# EAGLE board foxBMS_BMS-Slave (EAGLE 6.5.0), part 1 of 3
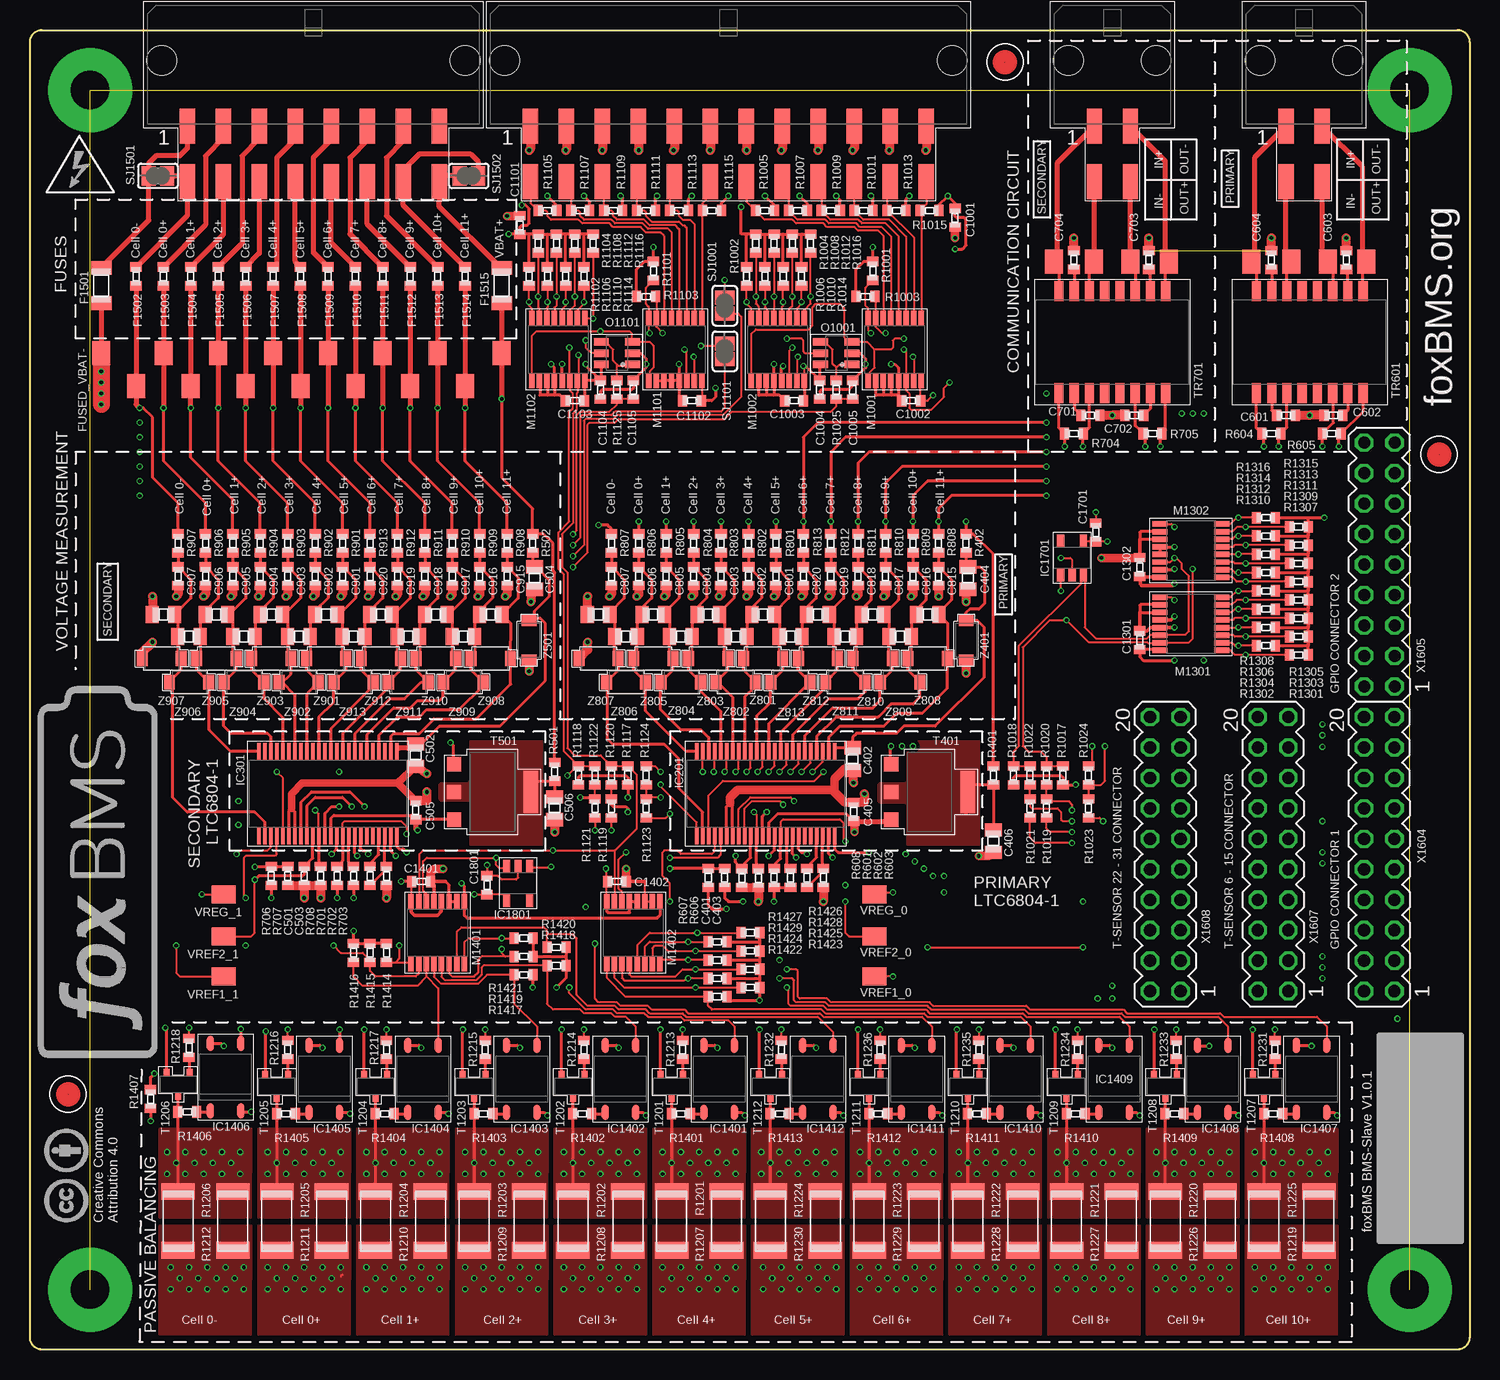
[diagram p19: board, top side]
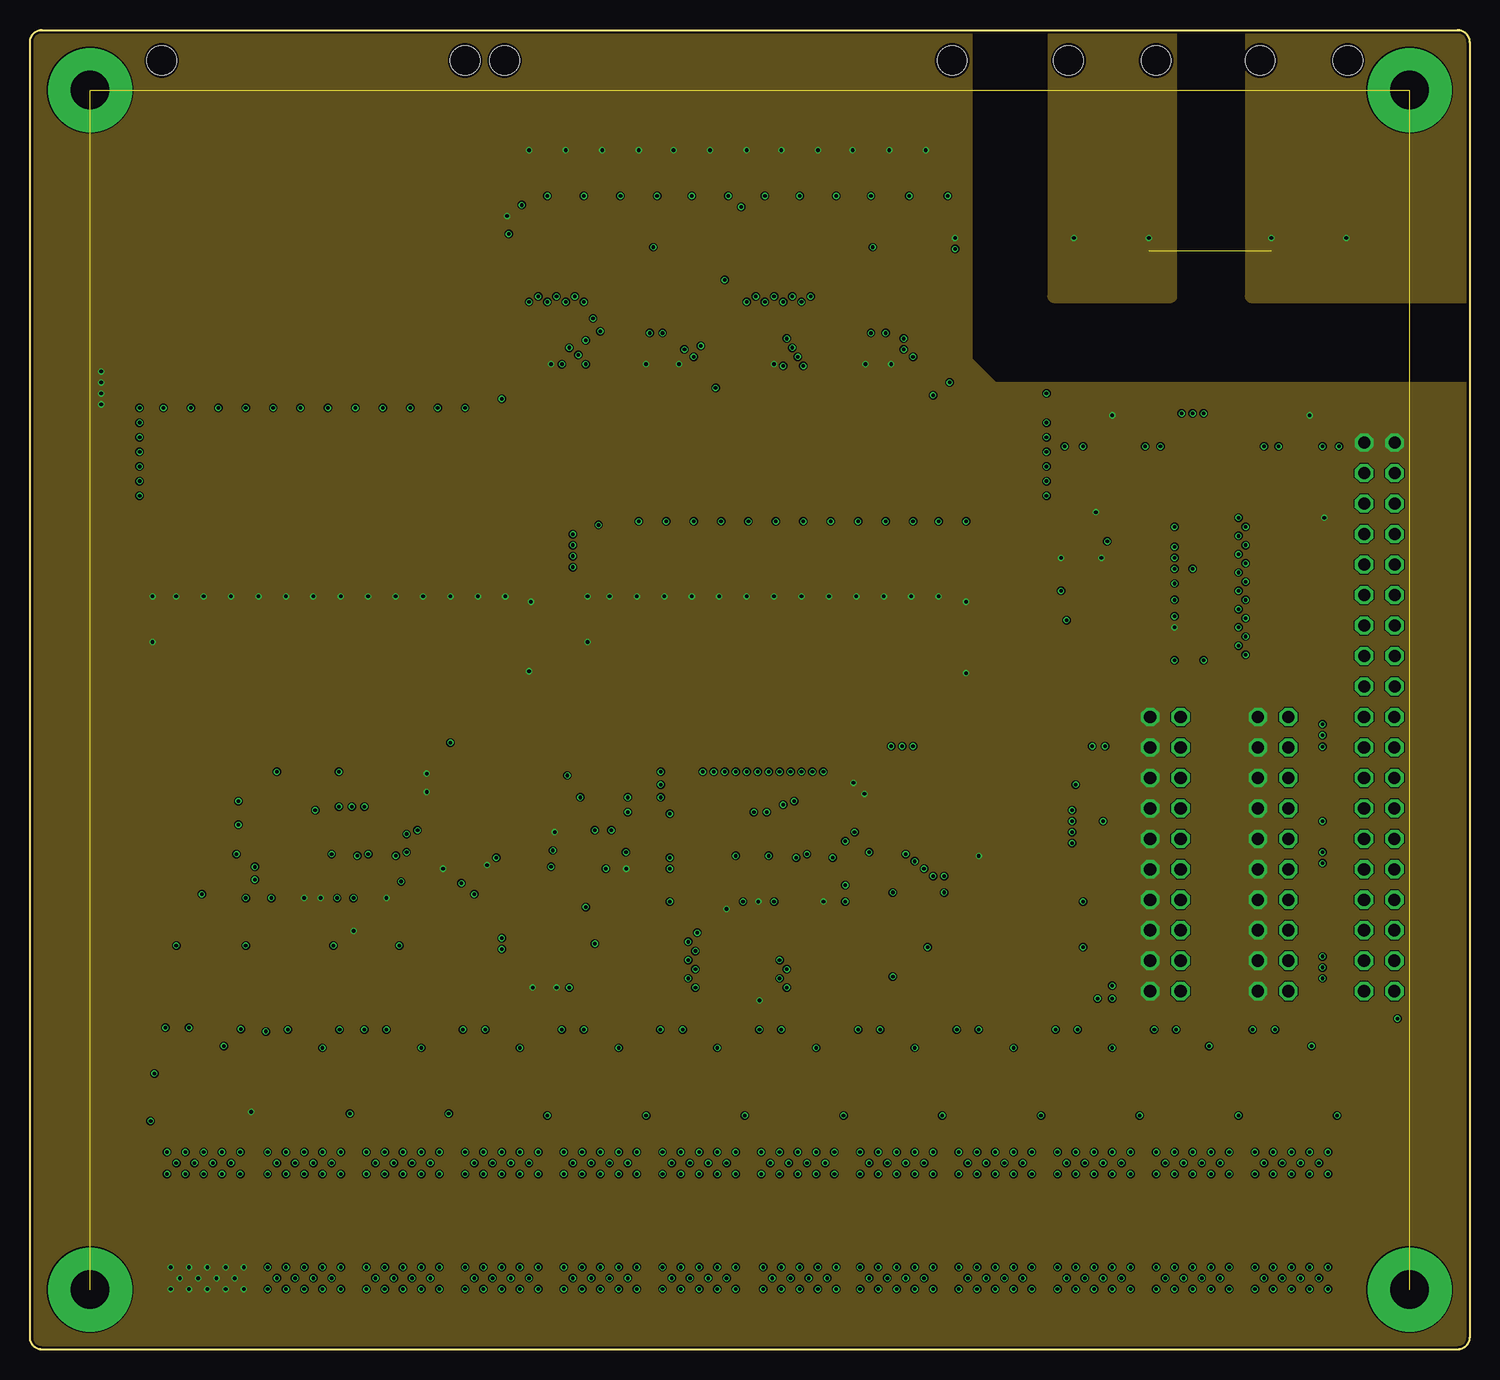
[diagram p20: board, inner layer FUSED_VBAT-]
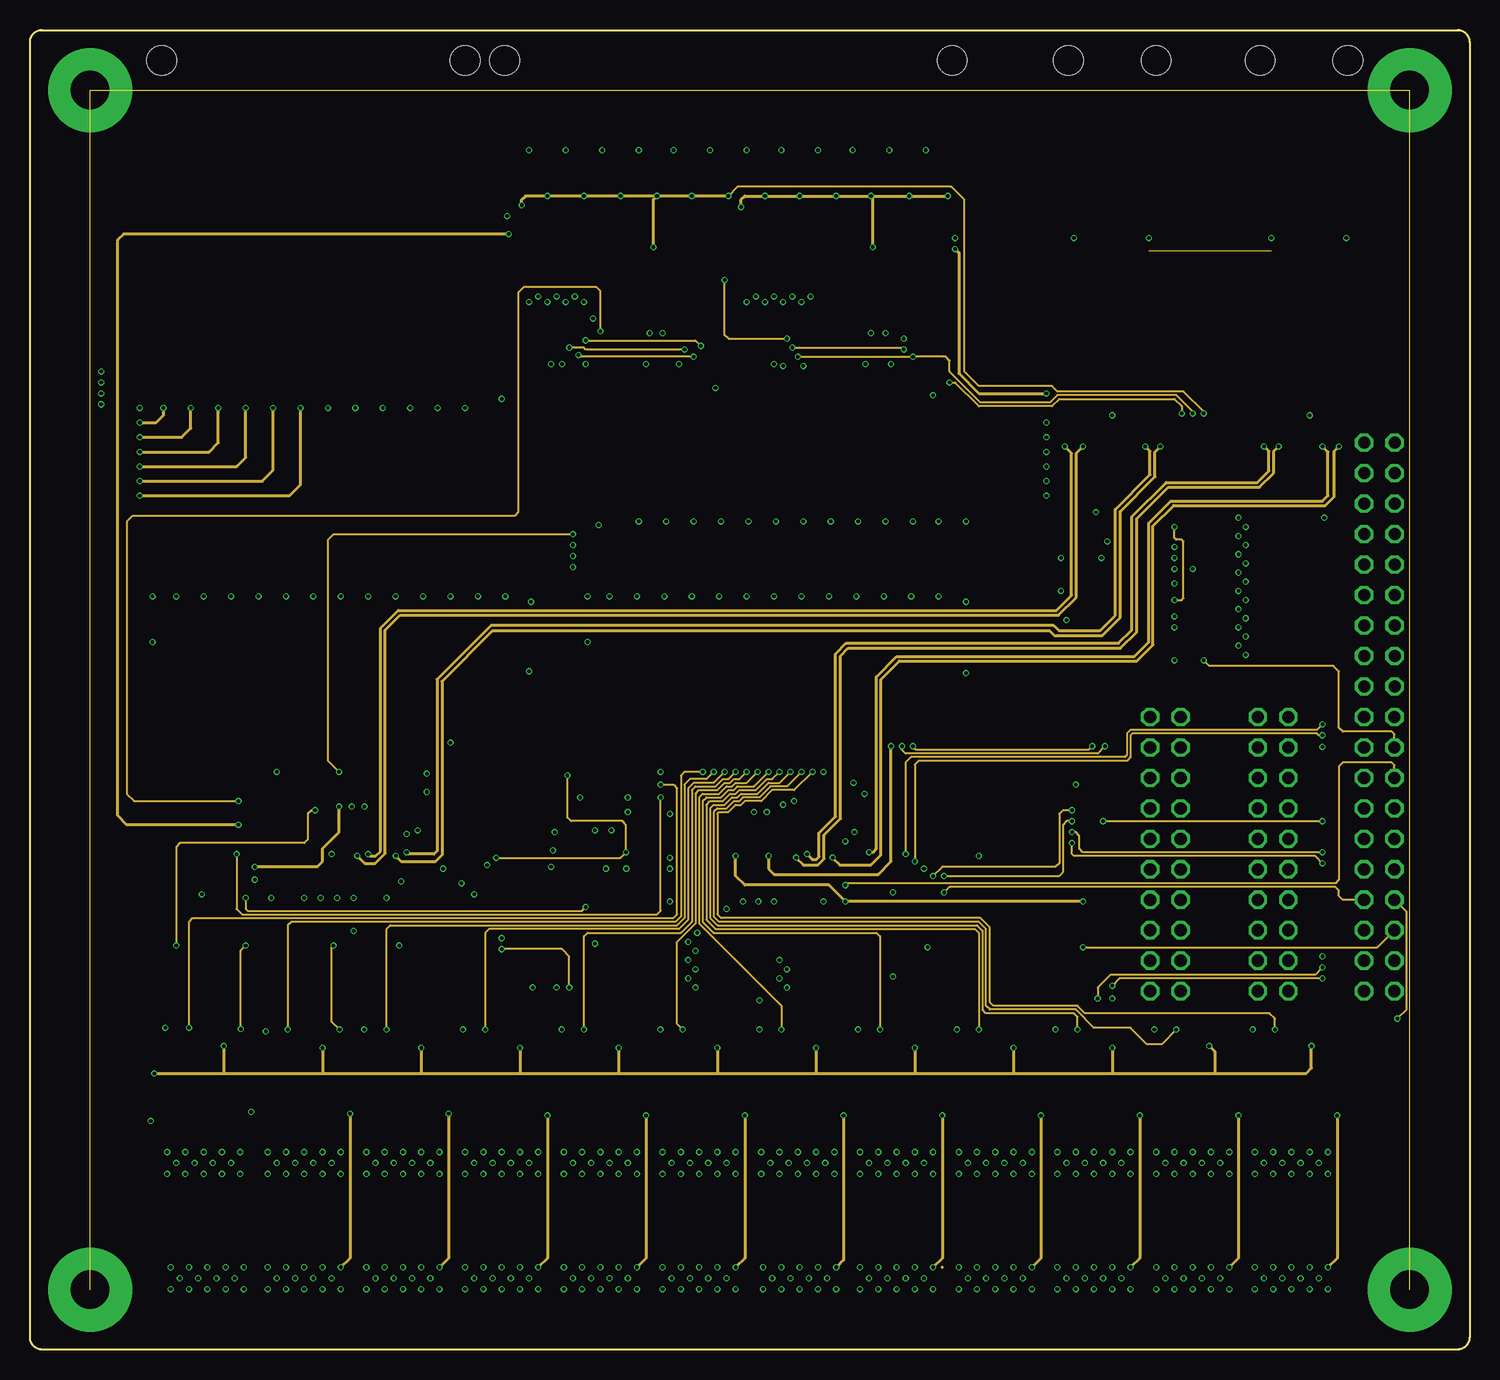
[diagram p21: board, inner layer Signals1]
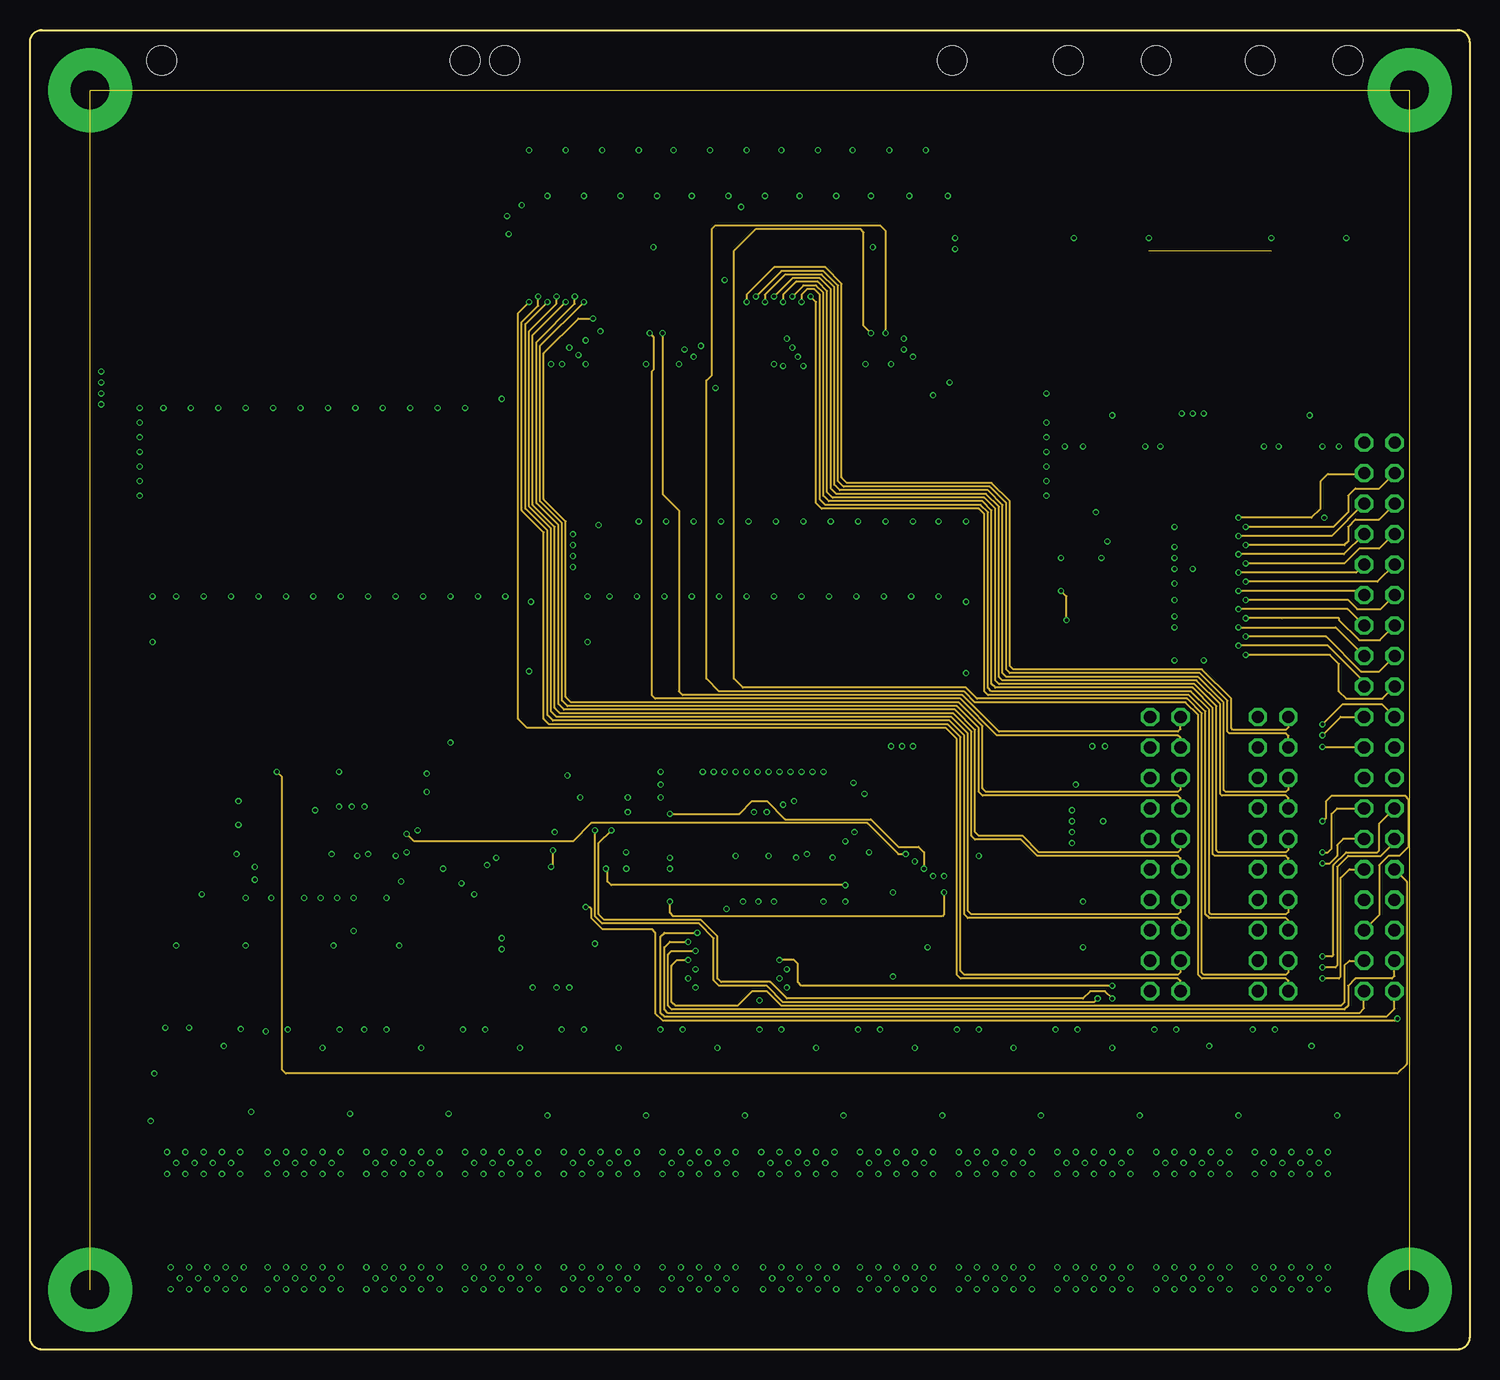
[diagram p22: board, inner layer Signals2]
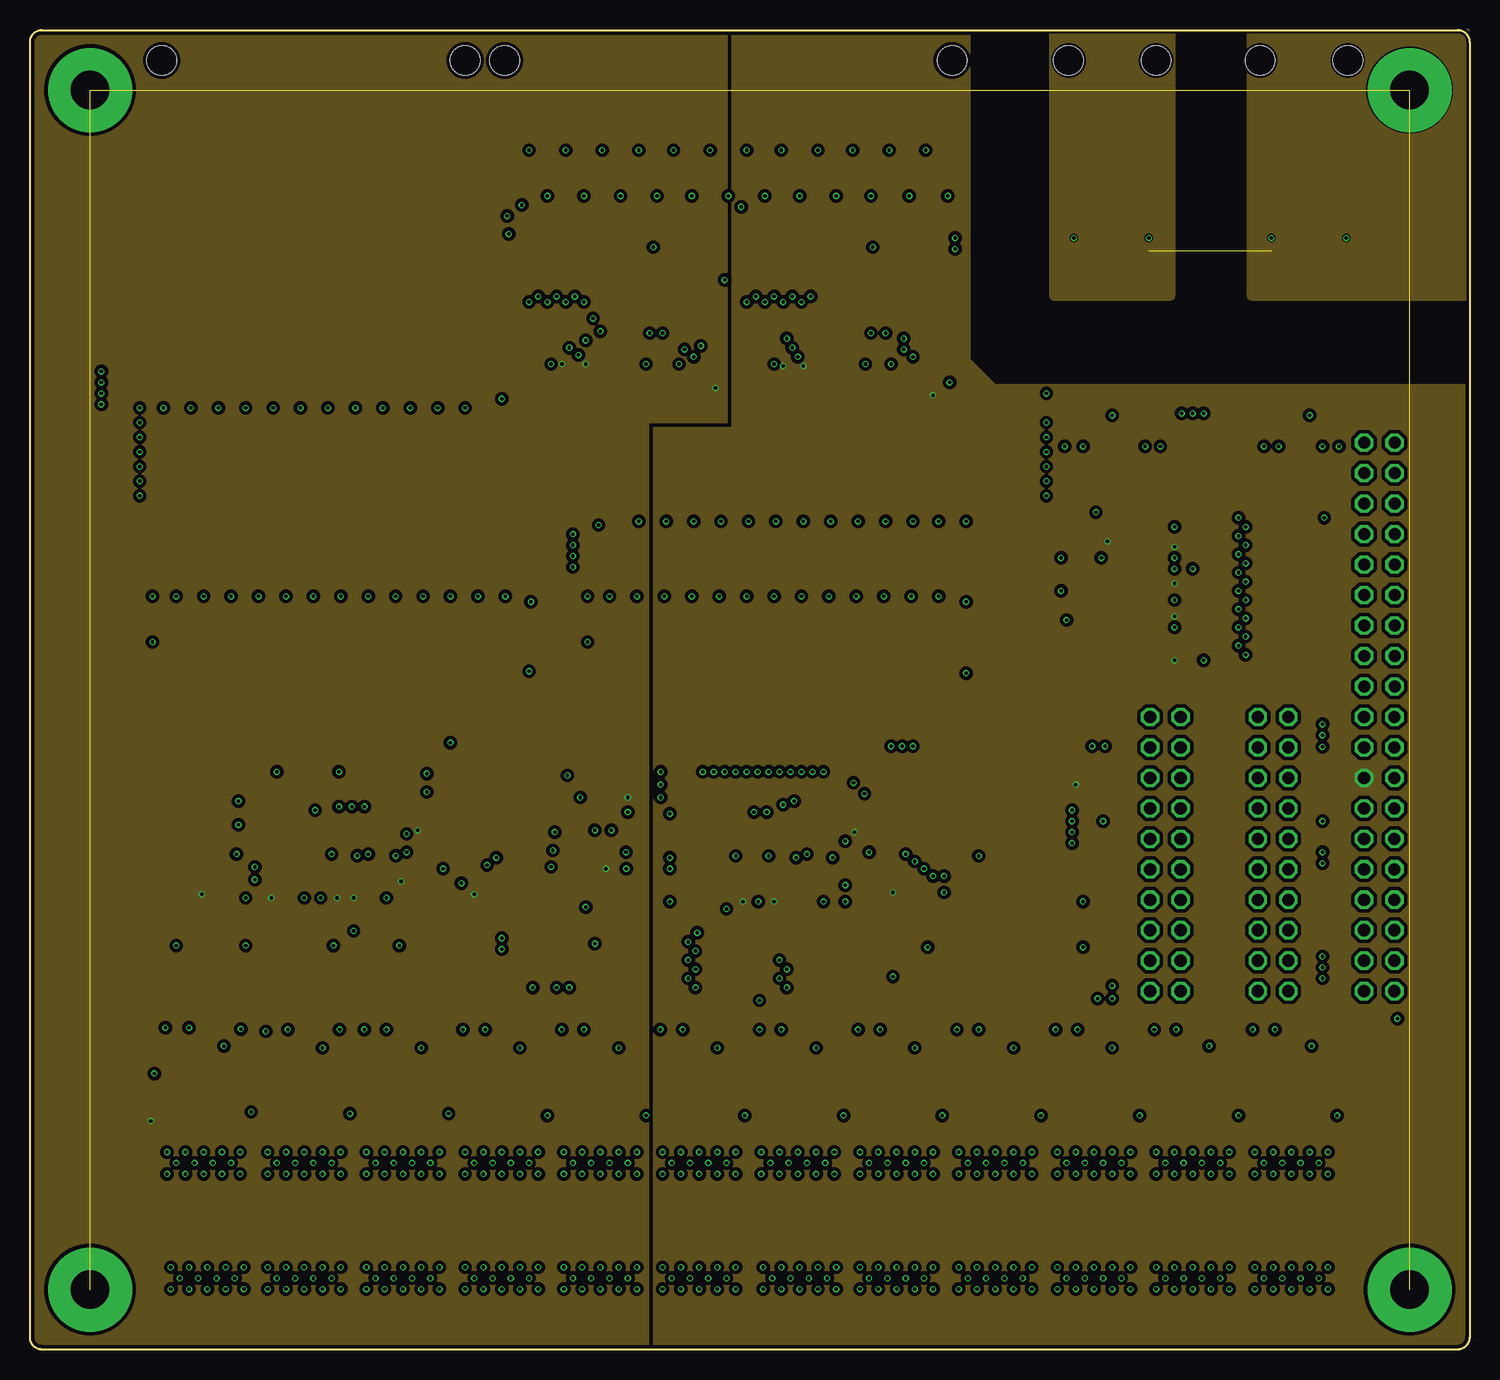
[diagram p23: board, inner layer V_REG]
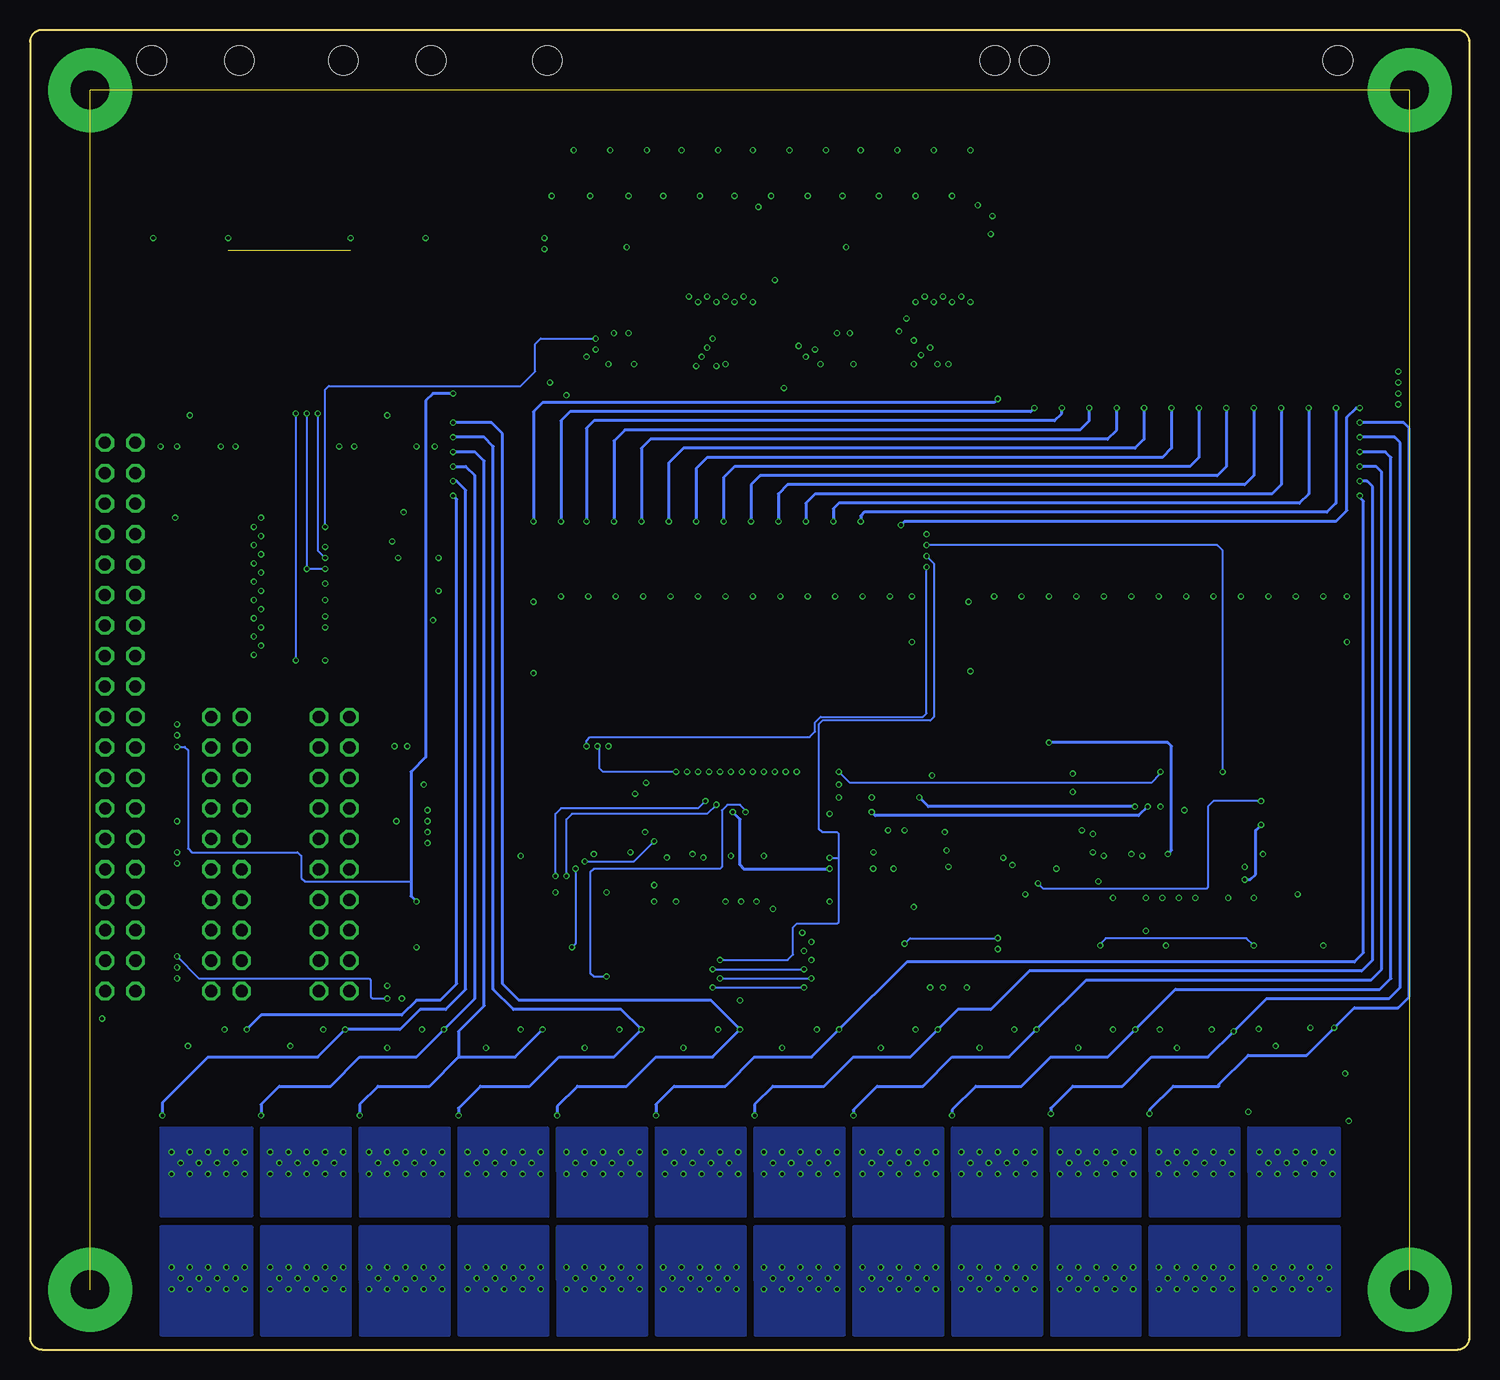
[diagram p24: board, bottom side, seen from below]

Size 120 x 110 mm. Coordinates in mm from the lower left corner, seen from the top.
Outline: 119,0 1,0 arc-90 0,1 0,109 arc-90 1,110 119,110 arc-90 120,109 120,1 arc-90 119,0
Copper layers (1+2*3+4*5+16): Top 0.018mm / dielectric 0.2mm / FUSED_VBAT- 0.035mm / dielectric 0.36mm / Signals1 0.035mm / dielectric 0.3mm / Signals2 0.035mm / dielectric 0.36mm / V_REG 0.035mm / dielectric 0.2mm / Bottom 0.018mm
Design rules "Multi-CB_6L_100um-Tracks_OL35um-IL35um": minimum track width 0.1mm, minimum drill 0.2mm, track to track 0.1mm, track to pad 0.1mm, pad to pad 0.1mm, via to via 0.1mm, smd to smd 0mil, copper to edge 0.2mm, drill to drill 0.2mm, minimum pad ring 0.1mm, minimum via ring 0.1mm, stop-mask expansion 2mil, vias tented up to drill 0.45mm, thermal gap 0.2mm
Net classes: 1 DiffPair: width 0.254 mm

## Footprints (pad centres in the part's own frame; a part is rotated, then mirrored left to right if it is on the bottom)
0603 = smd 0.762 x 0.965: 1 -0.787,0; 2 0.787,0
0805 = smd 1.092 x 1.397: 1 -0.94,0; 2 0.94,0
1206 = smd 1.143 x 1.702: 1 -1.473,0; 2 1.473,0
IC_SMD_SSOP-48_(G48)_R_LINEAR_REV01 = smd 0.295 x 1.37: 1 -5.75,-3.535; 2 -5.25,-3.535; 3 -4.75,-3.535; 4 -4.25,-3.535; 5 -3.75,-3.535; 6 -3.25,-3.535; 7 -2.75,-3.535; 8 -2.25,-3.535; 9 -1.75,-3.535; 10 -1.25,-3.535; 11 -0.75,-3.535; 12 -0.25,-3.535; 13 0.25,-3.535; 14 0.75,-3.535; 15 1.25,-3.535; 16 1.75,-3.535; 17 2.25,-3.535; 18 2.75,-3.535; 19 3.25,-3.535; 20 3.75,-3.535; 21 4.25,-3.535; 22 4.75,-3.535; 23 5.25,-3.535; 24 5.75,-3.535; 25 5.75,3.535; 26 5.25,3.535; 27 4.75,3.535; 28 4.25,3.535; 29 3.75,3.535; 30 3.25,3.535; 31 2.75,3.535; 32 2.25,3.535; 33 1.75,3.535; 34 1.25,3.535; 35 0.75,3.535; 36 0.25,3.535; 37 -0.25,3.535; 38 -0.75,3.535; 39 -1.25,3.535; 40 -1.75,3.535; 41 -2.25,3.535; 42 -2.75,3.535; 43 -3.25,3.535; 44 -3.75,3.535; 45 -4.25,3.535; 46 -4.75,3.535; 47 -5.25,3.535; 48 -5.75,3.535
K_SMD_SOP-4_R_IXYS_REV01 = smd 0.6 x 1.3: 1 -1.27,-2.8; 2 1.27,-2.8; 3 1.27,2.8; 4 -1.27,2.8
IC_SMD_SOT23-5_R_MICROCHIP_REV01 = smd 0.6 x 1.1: 1 -0.95,-1.4; 2 0,-1.4; 3 0.95,-1.4; 4 0.95,1.4; 5 -0.95,1.4
PAD2.0X1.5MM = smd 2 x 1.5: P$1 0,0
IC_SMD_SSOP-16_(GN16)_R_LINEAR_REV01 = smd 0.457 x 1.27: 1 -2.223,-2.591; 2 -1.587,-2.591; 3 -0.953,-2.591; 4 -0.318,-2.591; 5 0.318,-2.591; 6 0.953,-2.591; 7 1.587,-2.591; 8 2.223,-2.591; 9 2.223,2.591; 10 1.587,2.591; 11 0.953,2.591; 12 0.318,2.591; 13 -0.318,2.591; 14 -0.953,2.591; 15 -1.587,2.591; 16 -2.223,2.591
IC_SMD_TSOT-23-6_(S6)_R_LINEAR_REV01 = smd 0.62 x 1.22: 1 -0.95,-1.31; 2 0,-1.31; 3 0.95,-1.31; 4 0.95,1.31; 5 0,1.31; 6 -0.95,1.31
2010 = smd 1.4 x 2.8: 1 -2.4,0; 2 2.5,0
SJ = smd 1.168 x 1.6: 1 -0.66,0; 2 0.66,0
SJ' = smd 1.168 x 1.6: 1 -0.762,0; 2 0.762,0
D_SMD_SOT223_(SC-73)_R_NXP_REV01 = smd 1.2 x 1.2: 1 -2.3,-3.2; 2 0,-3.2; 3 2.3,-3.2 | smd 3.5 x 1.2: 4 0,3.2
D_SMD_SOT23_(TO-236AB)_R_NXP_REV01 = smd 0.5 x 0.6: 1 -0.95,-1; 2 0.95,-1; 3 0,1
TR_SMD_SOIC-16_(12,70MMX9,53MMX5,97MM)_R_PULSE_REV01 = smd 0.76 x 1.65: 1 -4.445,-4.255; 2 -3.175,-4.255; 3 -1.905,-4.255; 4 -0.635,-4.255; 5 0.635,-4.255; 6 1.905,-4.255; 7 3.175,-4.255; 8 4.445,-4.255; 9 4.445,4.255; 10 3.175,4.255; 11 1.905,4.255; 12 0.635,4.255; 13 -0.635,4.255; 14 -1.905,4.255; 15 -3.175,4.255; 16 -4.445,4.255
X_SMD_MOLEX_43045-0408_R_REV01 = smd 1.27 x 2.92: 1 1.5,5.47; 2 -1.5,5.47; 3 1.5,10.1; 4 -1.5,10.1 | hole 2.46: -3.65,0; 3.65,0
X_SMD_MOLEX_43045-1608_R_REV01 = smd 1.27 x 2.92: 1 10.5,5.47; 2 7.5,5.47; 3 4.5,5.47; 4 1.5,5.47; 5 -1.5,5.47; 6 -4.5,5.47; 7 -7.5,5.47; 8 -10.5,5.47; 9 10.5,10.1; 10 7.5,10.1; 11 4.5,10.1; 12 1.5,10.1; 13 -1.5,10.1; 14 -4.5,10.1; 15 -7.5,10.1; 16 -10.5,10.1 | hole 2.46: 12.65,0; -12.65,0
MA10-2 = drill 1.016 pad 1.524 octagon: 1 -11.43,-1.27; 2 -11.43,1.27; 3 -8.89,-1.27; 4 -8.89,1.27; 5 -6.35,-1.27; 6 -6.35,1.27; 7 -3.81,-1.27; 8 -3.81,1.27; 9 -1.27,-1.27; 10 -1.27,1.27; 11 1.27,-1.27; 12 1.27,1.27; 13 3.81,-1.27; 14 3.81,1.27; 15 6.35,-1.27; 16 6.35,1.27; 17 8.89,-1.27; 18 8.89,1.27; 19 11.43,-1.27; 20 11.43,1.27
MA09-2 = drill 1.016 octagon: 1 -10.16,-1.27; 2 -10.16,1.27; 3 -7.62,-1.27; 4 -7.62,1.27; 5 -5.08,-1.27; 6 -5.08,1.27; 7 -2.54,-1.27; 8 -2.54,1.27; 9 0,-1.27; 10 0,1.27; 11 2.54,-1.27; 12 2.54,1.27; 13 5.08,-1.27; 14 5.08,1.27; 15 7.62,-1.27; 16 7.62,1.27; 17 10.16,-1.27; 18 10.16,1.27
X_SMD_MOLEX_43045-2408_R_REV01 = smd 1.27 x 2.92: 1 16.5,5.47; 2 13.5,5.47; 3 10.5,5.47; 4 7.5,5.47; 5 4.5,5.47; 6 1.5,5.47; 7 -1.5,5.47; 8 -4.5,5.47; 9 -7.5,5.47; 10 -10.5,5.47; 11 -13.5,5.47; 12 -16.5,5.47; 13 16.5,10.1; 14 13.5,10.1; 15 10.5,10.1; 16 7.5,10.1; 17 4.5,10.1; 18 1.5,10.1; 19 -1.5,10.1; 20 -4.5,10.1; 21 -7.5,10.1; 22 -10.5,10.1; 23 -13.5,10.1; 24 -16.5,10.1 | hole 2.46: 18.65,0; -18.65,0
D_SMD_SOD-123_R_ON_REV01 = smd 0.91 x 1.22: A -1.635,0; K 1.635,0

## Placement (x,y rotation side)
C401  1uF, 20%, 16V  [0603]  59.35,39.3 90 top
C402  100nF, 10%, 100V  [0805]  68.58,49.23 270 top
C403  1uF, 20%, 16V  [0603]  60.72,39.3 90 top
C404  100nF, 10%, 100V  [0805]  78.18,64.31 270 top
C405  1uF, 20%, 16V  [0603]  68.67,44.82 270 top
C406  100nF, 10%, 100V  [0805]  80.31,42.37 90 top
C501  1uF, 20%, 16V  [0603]  22.86,39.47 90 top
C502  100nF, 10%, 100V  [0805]  32.16,49.53 270 top
C503  1uF, 20%, 16V  [0603]  24.23,39.47 90 top
C504  100nF, 10%, 100V  [0805]  42.06,64.31 270 top
C505  1uF, 20%, 16V  [0603]  32.16,44.96 270 top
C506  100nF, 10%, 100V  [0805]  43.74,45.11 90 top
C601  100pF, 15%, 25V  [0603]  104.7,77.88 180 top
C602  100pF, 15%, 25V  [0603]  108.66,77.88 0 top
C603  1uF, 20%, 25V  [0603]  109.73,90.83 270 top
C604  1uF, 20%, 25V  [0603]  103.48,90.83 270 top
C701  100pF, 15%, 25V  [0603]  88.39,77.88 180 top
C702  100pF, 15%, 25V  [0603]  92.05,77.88 0 top
C703  1uF, 20%, 25V  [0603]  93.27,90.83 270 top
C704  1uF, 20%, 25V  [0603]  87.02,90.83 270 top
C801  10nF, 100V, 10%  [0603]  62.18,64.47 270 top
C802  10nF, 100V, 10%  [0603]  59.89,64.47 270 top
C803  10nF, 100V, 10%  [0603]  57.61,64.47 270 top
C804  10nF, 100V, 10%  [0603]  55.32,64.47 270 top
C805  10nF, 100V, 10%  [0603]  53.04,64.47 270 top
C806  10nF, 100V, 10%  [0603]  50.75,64.47 270 top
C807  10nF, 100V, 10%  [0603]  48.46,64.47 270 top
C808  OPT: 100nF, 25V  [0805]  61.11,61.26 0 top
C809  OPT: 100nF, 25V  [0805]  58.83,59.44 0 top
C810  OPT: 100nF, 25V  [0805]  56.54,61.26 0 top
C811  OPT: 100nF, 25V  [0805]  54.25,59.44 0 top
C812  OPT: 100nF, 25V  [0805]  51.97,61.26 0 top
C813  OPT: 100nF, 25V  [0805]  49.68,59.44 0 top
C814  OPT: 100nF, 25V  [0805]  47.4,61.26 0 top
C815  10nF, 100V, 10%  [0603]  75.74,64.47 270 top
C816  10nF, 100V, 10%  [0603]  73.61,64.47 270 top
C817  10nF, 100V, 10%  [0603]  71.32,64.47 270 top
C818  10nF, 100V, 10%  [0603]  69.04,64.47 270 top
C819  10nF, 100V, 10%  [0603]  66.75,64.47 270 top
C820  10nF, 100V, 10%  [0603]  64.47,64.47 270 top
C821  OPT: 100nF, 25V  [0805]  74.83,61.26 0 top
C822  OPT: 100nF, 25V  [0805]  72.54,59.44 0 top
C823  OPT: 100nF, 25V  [0805]  70.26,61.26 0 top
C824  OPT: 100nF, 25V  [0805]  67.97,59.44 0 top
C825  OPT: 100nF, 25V  [0805]  65.68,61.26 0 top
C826  OPT: 100nF, 25V  [0805]  63.4,59.44 0 top
C901  10nF, 100V, 10%  [0603]  26.06,64.47 270 top
C902  10nF, 100V, 10%  [0603]  23.77,64.47 270 top
C903  10nF, 100V, 10%  [0603]  21.49,64.47 270 top
C904  10nF, 100V, 10%  [0603]  19.2,64.47 270 top
C905  10nF, 100V, 10%  [0603]  16.92,64.47 270 top
C906  10nF, 100V, 10%  [0603]  14.63,64.47 270 top
C907  10nF, 100V, 10%  [0603]  12.34,64.47 270 top
C908  OPT: 100nF, 25V  [0805]  24.69,61.26 0 top
C909  OPT: 100nF, 25V  [0805]  22.4,59.44 0 top
C910  OPT: 100nF, 25V  [0805]  20.12,61.26 0 top
C911  OPT: 100nF, 25V  [0805]  17.83,59.44 0 top
C912  OPT: 100nF, 25V  [0805]  15.54,61.26 0 top
C913  OPT: 100nF, 25V  [0805]  13.26,59.44 0 top
C914  OPT: 100nF, 25V  [0805]  11.13,61.26 0 top
C915  10nF, 100V, 10%  [0603]  39.78,64.47 270 top
C916  10nF, 100V, 10%  [0603]  37.49,64.47 270 top
C917  10nF, 100V, 10%  [0603]  35.2,64.47 270 top
C918  10nF, 100V, 10%  [0603]  32.92,64.47 270 top
C919  10nF, 100V, 10%  [0603]  30.63,64.47 270 top
C920  10nF, 100V, 10%  [0603]  28.35,64.47 270 top
C921  OPT: 100nF, 25V  [0805]  38.4,61.26 0 top
C922  OPT: 100nF, 25V  [0805]  36.12,59.44 0 top
C923  OPT: 100nF, 25V  [0805]  33.83,61.26 0 top
C924  OPT: 100nF, 25V  [0805]  31.55,59.44 0 top
C925  OPT: 100nF, 25V  [0805]  29.26,61.26 0 top
C926  OPT: 100nF, 25V  [0805]  26.97,59.44 0 top
C1001  100nF, 20%, 16V  [0603]  77.11,94.34 90 top
C1002  1uF, 20%, 16V  [0603]  73.46,79.1 0 top
C1003  1uF, 20%, 16V  [0603]  63.7,79.1 0 top
C1004  1uF, 20%, 16V  [0603]  65.84,80.01 90 top
C1005  10nF, 20%, 16V  [0603]  68.58,80.01 270 top
C1101  100nF, 20%, 16V  [0603]  40.84,93.73 270 top
C1102  1uF, 20%, 16V  [0603]  55.17,79.1 0 top
C1103  1uF, 20%, 16V  [0603]  45.42,79.1 0 top
C1104  1uF, 20%, 16V  [0603]  47.55,80.01 90 top
C1105  10nF, 20%, 16V  [0603]  50.29,80.01 270 top
C1301  1uF, 20%, 16V  [0603]  92.51,59.13 270 top
C1302  1uF, 20%, 16V  [0603]  92.51,65.23 270 top
C1401  1uF, 20%, 16V  [0603]  32.61,39.01 180 top
C1402  1uF, 20%, 16V  [0603]  48.92,39.01 180 top
C1701  100nF, 20%, 16V  [0603]  88.85,68.12 270 top
C1801  100nF, 20%, 16V  [0603]  38.1,38.71 270 top
F1501  0.5A, 63V, 0.25R  [1206]  5.94,88.7 270 top
F1502  FUSE: 0.250A, 32V, 0.57R  [0603]  8.84,89.46 270 top
F1503  FUSE: 0.250A, 32V, 0.57R  [0603]  11.13,89.46 270 top
F1504  FUSE: 0.250A, 32V, 0.57R  [0603]  13.41,89.46 270 top
F1505  FUSE: 0.250A, 32V, 0.57R  [0603]  15.7,89.46 270 top
F1506  FUSE: 0.250A, 32V, 0.57R  [0603]  17.98,89.46 270 top
F1507  FUSE: 0.250A, 32V, 0.57R  [0603]  20.27,89.46 270 top
F1508  FUSE: 0.250A, 32V, 0.57R  [0603]  22.56,89.46 270 top
F1509  FUSE: 0.250A, 32V, 0.57R  [0603]  24.84,89.46 270 top
F1510  FUSE: 0.250A, 32V, 0.57R  [0603]  27.13,89.46 270 top
F1511  FUSE: 0.250A, 32V, 0.57R  [0603]  29.41,89.46 270 top
F1512  FUSE: 0.250A, 32V, 0.57R  [0603]  31.7,89.46 270 top
F1513  FUSE: 0.250A, 32V, 0.57R  [0603]  33.99,89.46 270 top
F1514  FUSE: 0.250A, 32V, 0.57R  [0603]  36.27,89.46 270 top
F1515  0.5A, 63V, 0.25R  [1206]  39.32,88.7 270 top
IC201  LTC6804HG-1#PBF  [IC_SMD_SSOP-48_(G48)_R_LINEAR_REV01]  61.33,46.33 180 top
IC301  LTC6804HG-1#PBF  [IC_SMD_SSOP-48_(G48)_R_LINEAR_REV01]  24.84,46.33 180 top
IC1401  CPC1008N  [K_SMD_SOP-4_R_IXYS_REV01]  57.45,22.56 0 top
IC1402  CPC1008N  [K_SMD_SOP-4_R_IXYS_REV01]  49.23,22.56 0 top
IC1403  CPC1008N  [K_SMD_SOP-4_R_IXYS_REV01]  41,22.56 0 top
IC1404  CPC1008N  [K_SMD_SOP-4_R_IXYS_REV01]  32.77,22.56 0 top
IC1405  CPC1008N  [K_SMD_SOP-4_R_IXYS_REV01]  24.54,22.56 0 top
IC1406  CPC1008N  [K_SMD_SOP-4_R_IXYS_REV01]  16.31,22.71 0 top
IC1407  CPC1008N  [K_SMD_SOP-4_R_IXYS_REV01]  106.83,22.56 0 top
IC1408  CPC1008N  [K_SMD_SOP-4_R_IXYS_REV01]  98.6,22.56 0 top
IC1409  CPC1008N  [K_SMD_SOP-4_R_IXYS_REV01]  90.37,22.56 0 top
IC1410  CPC1008N  [K_SMD_SOP-4_R_IXYS_REV01]  82.14,22.56 0 top
IC1411  CPC1008N  [K_SMD_SOP-4_R_IXYS_REV01]  73.91,22.56 0 top
IC1412  CPC1008N  [K_SMD_SOP-4_R_IXYS_REV01]  65.68,22.56 0 top
IC1701  24AA02UID  [IC_SMD_SOT23-5_R_MICROCHIP_REV01]  86.87,65.99 0 top
IC1801  24AA02UID  [IC_SMD_SOT23-5_R_MICROCHIP_REV01]  40.69,38.86 180 top
LSP401  PAD_2.0X1.5MM  [PAD2.0X1.5MM]  70.41,37.95 0 top
LSP402  PAD_2.0X1.5MM  [PAD2.0X1.5MM]  70.41,31.09 0 top
LSP403  PAD_2.0X1.5MM  [PAD2.0X1.5MM]  70.41,34.44 0 top
LSP501  PAD_2.0X1.5MM  [PAD2.0X1.5MM]  16.15,37.95 0 top
LSP502  PAD_2.0X1.5MM  [PAD2.0X1.5MM]  16.15,31.09 0 top
LSP503  PAD_2.0X1.5MM  [PAD2.0X1.5MM]  16.15,34.44 0 top
LSP601  PAD_2.0X1.5MM  [PAD2.0X1.5MM]  101.8,90.68 90 top
LSP602  PAD_2.0X1.5MM  [PAD2.0X1.5MM]  105.16,90.68 90 top
LSP603  PAD_2.0X1.5MM  [PAD2.0X1.5MM]  108.2,90.68 90 top
LSP604  PAD_2.0X1.5MM  [PAD2.0X1.5MM]  111.4,90.68 90 top
LSP701  PAD_2.0X1.5MM  [PAD2.0X1.5MM]  85.34,90.68 90 top
LSP702  PAD_2.0X1.5MM  [PAD2.0X1.5MM]  88.7,90.68 90 top
LSP703  PAD_2.0X1.5MM  [PAD2.0X1.5MM]  91.74,90.68 90 top
LSP704  PAD_2.0X1.5MM  [PAD2.0X1.5MM]  94.95,90.68 90 top
LSP1501  PAD_2.0X1.5MM  [PAD2.0X1.5MM]  5.94,83.06 90 top
LSP1502  PAD_2.0X1.5MM  [PAD2.0X1.5MM]  8.84,80.31 90 top
LSP1503  PAD_2.0X1.5MM  [PAD2.0X1.5MM]  11.13,83.06 90 top
LSP1504  PAD_2.0X1.5MM  [PAD2.0X1.5MM]  13.41,80.31 90 top
LSP1505  PAD_2.0X1.5MM  [PAD2.0X1.5MM]  15.7,83.06 90 top
LSP1506  PAD_2.0X1.5MM  [PAD2.0X1.5MM]  17.98,80.31 90 top
LSP1507  PAD_2.0X1.5MM  [PAD2.0X1.5MM]  20.27,83.06 90 top
LSP1508  PAD_2.0X1.5MM  [PAD2.0X1.5MM]  22.56,80.31 90 top
LSP1509  PAD_2.0X1.5MM  [PAD2.0X1.5MM]  24.84,83.06 90 top
LSP1510  PAD_2.0X1.5MM  [PAD2.0X1.5MM]  27.13,80.31 90 top
LSP1511  PAD_2.0X1.5MM  [PAD2.0X1.5MM]  29.41,83.06 90 top
LSP1512  PAD_2.0X1.5MM  [PAD2.0X1.5MM]  31.7,80.31 90 top
LSP1513  PAD_2.0X1.5MM  [PAD2.0X1.5MM]  33.99,83.06 90 top
LSP1514  PAD_2.0X1.5MM  [PAD2.0X1.5MM]  36.27,80.31 90 top
LSP1515  PAD_2.0X1.5MM  [PAD2.0X1.5MM]  39.32,83.06 90 top
M1001  LTC1380CGN  [IC_SMD_SSOP-16_(GN16)_R_LINEAR_REV01]  72.09,83.36 180 top
M1002  LTC1380CGN  [IC_SMD_SSOP-16_(GN16)_R_LINEAR_REV01]  62.33,83.36 180 top
M1101  LTC1380CGN  [IC_SMD_SSOP-16_(GN16)_R_LINEAR_REV01]  53.8,83.36 180 top
M1102  LTC1380CGN  [IC_SMD_SSOP-16_(GN16)_R_LINEAR_REV01]  44.04,83.36 180 top
M1301  LTC1380CGN  [IC_SMD_SSOP-16_(GN16)_R_LINEAR_REV01]  96.77,60.5 90 top
M1302  LTC1380CGN  [IC_SMD_SSOP-16_(GN16)_R_LINEAR_REV01]  96.77,66.6 90 top
M1401  LTC1380CGN  [IC_SMD_SSOP-16_(GN16)_R_LINEAR_REV01]  33.99,34.75 0 top
M1402  LTC1380CGN  [IC_SMD_SSOP-16_(GN16)_R_LINEAR_REV01]  50.29,34.75 0 top
O1001  LTC6255CS6  [IC_SMD_TSOT-23-6_(S6)_R_LINEAR_REV01]  67.21,83.06 90 top
O1101  LTC6255CS6  [IC_SMD_TSOT-23-6_(S6)_R_LINEAR_REV01]  48.92,83.06 90 top
R401  100R, 1%, 1/10W  [0603]  80.31,47.85 90 top
R402  100R, 1%, 1/10W  [0603]  78.03,67.21 270 top
R501  100R, 1%, 1/10W  [0603]  43.74,48.16 90 top
R502  100R, 1%, 1/10W  [0603]  41.91,67.21 270 top
R601  0R  [0603]  63.4,39.32 270 top
R602  806, 1%, 1/10W  [0603]  64.77,39.32 270 top
R603  1.21k, 1%, 1/10W  [0603]  66.14,39.32 270 top
R604  120R, 1%, 1/10W  [0603]  103.48,76.35 0 top
R605  120R, 1%, 1/10W  [0603]  108.51,76.35 0 top
R606  OPT: 0R  [0603]  57.91,39.32 270 top
R607  0R  [0603]  56.54,39.32 90 top
R608  1M, 10%, 1/10W  [0603]  62.03,39.32 270 top
R701  0R  [0603]  26.97,39.47 270 top
R702  806, 1%, 1/10W  [0603]  28.35,39.47 270 top
R703  1.21k, 1%, 1/10W  [0603]  29.72,39.47 270 top
R704  120R, 1%, 1/10W  [0603]  87.02,76.35 0 top
R705  120R, 1%, 1/10W  [0603]  93.57,76.35 0 top
R706  OPT: 0R  [0603]  20.12,39.47 270 top
R707  0R  [0603]  21.49,39.47 90 top
R708  1M, 10%, 1/10W  [0603]  25.6,39.47 270 top
R801  100R, 1%, 1/10W  [0603]  62.18,67.21 270 top
R802  100R, 1%, 1/10W  [0603]  59.89,67.21 270 top
R803  100R, 1%, 1/10W  [0603]  57.61,67.21 270 top
R804  100R, 1%, 1/10W  [0603]  55.32,67.21 270 top
R805  100R, 1%, 1/10W  [0603]  53.04,67.21 270 top
R806  100R, 1%, 1/10W  [0603]  50.75,67.21 270 top
R807  100R, 1%, 1/10W  [0603]  48.46,67.21 270 top
R808  100R, 1%, 1/10W  [0603]  75.74,67.21 270 top
R809  100R, 1%, 1/10W  [0603]  73.61,67.21 270 top
R810  100R, 1%, 1/10W  [0603]  71.32,67.21 270 top
R811  100R, 1%, 1/10W  [0603]  69.04,67.21 270 top
R812  100R, 1%, 1/10W  [0603]  66.75,67.21 270 top
R813  100R, 1%, 1/10W  [0603]  64.47,67.21 270 top
R901  100R, 1%, 1/10W  [0603]  26.06,67.21 270 top
R902  100R, 1%, 1/10W  [0603]  23.77,67.21 270 top
R903  100R, 1%, 1/10W  [0603]  21.49,67.21 270 top
R904  100R, 1%, 1/10W  [0603]  19.2,67.21 270 top
R905  100R, 1%, 1/10W  [0603]  16.92,67.21 270 top
R906  100R, 1%, 1/10W  [0603]  14.63,67.21 270 top
R907  100R, 1%, 1/10W  [0603]  12.34,67.21 270 top
R908  100R, 1%, 1/10W  [0603]  39.78,67.21 270 top
R909  100R, 1%, 1/10W  [0603]  37.49,67.21 270 top
R910  100R, 1%, 1/10W  [0603]  35.2,67.21 270 top
R911  100R, 1%, 1/10W  [0603]  32.92,67.21 270 top
R912  100R, 1%, 1/10W  [0603]  30.63,67.21 270 top
R913  100R, 1%, 1/10W  [0603]  28.35,67.21 270 top
R1001  20k, 1%, 1/10W  [0603]  70.26,89.92 90 top
R1002  20k, 1%, 1/10W  [0603]  59.74,89.46 90 top
R1003  20k, 1%, 1/10W  [0603]  69.65,87.78 180 top
R1004  20k, 1%, 1/10W  [0603]  60.5,92.2 90 top
R1005  20k, 1%, 1/10W  [0603]  61.26,94.95 0 top
R1006  20k, 1%, 1/10W  [0603]  61.26,89.46 90 top
R1007  20k, 1%, 1/10W  [0603]  64.01,94.95 0 top
R1008  20k, 1%, 1/10W  [0603]  62.03,92.2 90 top
R1009  20k, 1%, 1/10W  [0603]  66.75,94.95 0 top
R1010  20k, 1%, 1/10W  [0603]  62.79,89.46 90 top
R1011  20k, 1%, 1/10W  [0603]  69.49,94.95 0 top
R1012  20k, 1%, 1/10W  [0603]  63.55,92.2 90 top
R1013  20k, 1%, 1/10W  [0603]  72.24,94.95 0 top
R1014  20k, 1%, 1/10W  [0603]  64.31,89.46 90 top
R1015  20k, 1%, 1/10W  [0603]  74.98,94.95 0 top
R1016  20k, 1%, 1/10W  [0603]  65.07,92.2 90 top
R1017  4.7k, 10%, 1/10W  [0603]  86.11,47.85 270 top
R1018  4.7k, 10%, 1/10W  [0603]  81.99,47.85 270 top
R1019  N/A  [0603]  84.73,45.11 90 top
R1020  0R  [0603]  84.73,47.85 270 top
R1021  N/A  [0603]  83.36,45.11 90 top
R1022  0R  [0603]  83.36,47.85 270 top
R1023  N/A  [0603]  88.24,45.11 90 top
R1024  0R  [0603]  88.24,47.85 270 top
R1025  100R, 1%, 1/10W  [0603]  67.21,80.01 270 top
R1101  20k, 1%, 1/10W  [0603]  51.97,89.92 90 top
R1102  20k, 1%, 1/10W  [0603]  41.61,89.46 90 top
R1103  20k, 1%, 1/10W  [0603]  51.36,87.78 180 top
R1104  20k, 1%, 1/10W  [0603]  42.37,92.2 90 top
R1105  20k, 1%, 1/10W  [0603]  43.13,94.95 0 top
R1106  20k, 1%, 1/10W  [0603]  43.13,89.46 90 top
R1107  20k, 1%, 1/10W  [0603]  45.87,94.95 0 top
R1108  20k, 1%, 1/10W  [0603]  43.89,92.2 90 top
R1109  20k, 1%, 1/10W  [0603]  48.62,94.95 0 top
R1110  20k, 1%, 1/10W  [0603]  44.65,89.46 90 top
R1111  20k, 1%, 1/10W  [0603]  51.36,94.95 0 top
R1112  20k, 1%, 1/10W  [0603]  45.42,92.2 90 top
R1113  20k, 1%, 1/10W  [0603]  54.1,94.95 0 top
R1114  20k, 1%, 1/10W  [0603]  46.18,89.46 90 top
R1115  20k, 1%, 1/10W  [0603]  56.85,94.95 0 top
R1116  20k, 1%, 1/10W  [0603]  46.94,92.2 90 top
R1117  4.7k, 10%, 1/10W  [0603]  49.83,47.85 270 top
R1118  4.7k, 10%, 1/10W  [0603]  45.72,47.85 270 top
R1119  OPT: 0R  [0603]  48.46,45.11 90 top
R1120  0R  [0603]  48.46,47.85 270 top
R1121  OPT: 0R  [0603]  47.09,45.11 90 top
R1122  0R  [0603]  47.09,47.85 270 top
R1123  OPT: 0R  [0603]  51.36,45.11 90 top
R1124  0R  [0603]  51.36,47.85 270 top
R1125  100R, 1%, 1/10W  [0603]  48.92,80.01 270 top
R1201  75R, 10%, 0.4W  [2010]  53.49,10.67 90 top
R1202  75R, 10%, 0.4W  [2010]  45.26,10.67 90 top
R1203  75R, 10%, 0.4W  [2010]  37.03,10.67 90 top
R1204  75R, 10%, 0.4W  [2010]  28.8,10.67 90 top
R1205  75R, 10%, 0.4W  [2010]  20.57,10.67 90 top
R1206  75R, 10%, 0.4W  [2010]  12.34,10.67 90 top
R1207  75R, 10%, 0.4W  [2010]  58.06,10.67 90 top
R1208  75R, 10%, 0.4W  [2010]  49.83,10.67 90 top
R1209  75R, 10%, 0.4W  [2010]  41.61,10.67 90 top
R1210  75R, 10%, 0.4W  [2010]  33.38,10.67 90 top
R1211  75R, 10%, 0.4W  [2010]  25.15,10.67 90 top
R1212  75R, 10%, 0.4W  [2010]  16.92,10.67 90 top
R1213  3.3k, 10%, 1/10W  [0603]  54.41,24.99 90 top
R1214  3.3k, 10%, 1/10W  [0603]  46.18,24.99 90 top
R1215  3.3k, 10%, 1/10W  [0603]  37.95,24.99 90 top
R1216  3.3k, 10%, 1/10W  [0603]  21.49,24.99 90 top
R1217  3.3k, 10%, 1/10W  [0603]  29.72,24.99 90 top
R1218  3.3k, 10%, 1/10W  [0603]  13.26,25.15 90 top
R1219  75R, 10%, 0.4W  [2010]  107.44,10.67 90 top
R1220  75R, 10%, 0.4W  [2010]  94.64,10.67 90 top
R1221  75R, 10%, 0.4W  [2010]  86.41,10.67 90 top
R1222  75R, 10%, 0.4W  [2010]  78.18,10.67 90 top
R1223  75R, 10%, 0.4W  [2010]  69.95,10.67 90 top
R1224  75R, 10%, 0.4W  [2010]  61.72,10.67 90 top
R1225  75R, 10%, 0.4W  [2010]  102.87,10.67 90 top
R1226  75R, 10%, 0.4W  [2010]  99.21,10.67 90 top
R1227  75R, 10%, 0.4W  [2010]  90.98,10.67 90 top
R1228  75R, 10%, 0.4W  [2010]  82.75,10.67 90 top
R1229  75R, 10%, 0.4W  [2010]  74.52,10.67 90 top
R1230  75R, 10%, 0.4W  [2010]  66.29,10.67 90 top
R1231  3.3k, 10%, 1/10W  [0603]  103.78,24.99 90 top
R1232  3.3k, 10%, 1/10W  [0603]  62.64,24.99 90 top
R1233  3.3k, 10%, 1/10W  [0603]  95.55,24.99 90 top
R1234  3.3k, 10%, 1/10W  [0603]  87.33,24.99 90 top
R1235  3.3k, 10%, 1/10W  [0603]  79.1,24.99 90 top
R1236  3.3k, 10%, 1/10W  [0603]  70.87,24.99 90 top
R1301  10k, 10%, 1/10W  [0603]  105.77,57.91 0 top
R1302  10k, 10%, 1/10W  [0603]  103.02,58.67 0 top
R1303  10k, 10%, 1/10W  [0603]  105.77,59.44 0 top
R1304  10k, 10%, 1/10W  [0603]  103.02,60.2 0 top
R1305  10k, 10%, 1/10W  [0603]  105.77,60.96 0 top
R1306  10k, 10%, 1/10W  [0603]  103.02,61.72 0 top
R1307  10k, 10%, 1/10W  [0603]  105.77,62.48 0 top
R1308  10k, 10%, 1/10W  [0603]  103.02,63.25 0 top
R1309  10k, 10%, 1/10W  [0603]  105.77,64.01 0 top
R1310  10k, 10%, 1/10W  [0603]  103.02,64.77 0 top
R1311  10k, 10%, 1/10W  [0603]  105.77,65.53 0 top
R1312  10k, 10%, 1/10W  [0603]  103.02,66.29 0 top
R1313  10k, 10%, 1/10W  [0603]  105.77,67.06 0 top
R1314  10k, 10%, 1/10W  [0603]  103.02,67.82 0 top
R1315  10k, 10%, 1/10W  [0603]  105.77,68.58 0 top
R1316  10k, 10%, 1/10W  [0603]  103.02,69.34 0 top
R1401  130, 10%, 1/10W  [0603]  54.25,19.66 180 top
R1402  130, 10%, 1/10W  [0603]  46.02,19.66 180 top
R1403  130, 10%, 1/10W  [0603]  37.8,19.66 180 top
R1404  130, 10%, 1/10W  [0603]  29.57,19.66 180 top
R1405  130, 10%, 1/10W  [0603]  21.34,19.66 180 top
R1406  130, 10%, 1/10W  [0603]  13.11,19.81 180 top
R1407  1k, 10%, 1/10W  [0603]  10.06,20.88 90 top
R1408  130, 10%, 1/10W  [0603]  103.63,19.66 180 top
R1409  130, 10%, 1/10W  [0603]  95.4,19.66 180 top
R1410  130, 10%, 1/10W  [0603]  87.17,19.66 180 top
R1411  130, 10%, 1/10W  [0603]  78.94,19.66 180 top
R1412  130, 10%, 1/10W  [0603]  70.71,19.66 180 top
R1413  130, 10%, 1/10W  [0603]  62.48,19.66 180 top
R1414  10k, 10%, 1/10W  [0603]  29.72,33.07 90 top
R1415  10k, 10%, 1/10W  [0603]  28.35,33.07 90 top
R1416  10k, 10%, 1/10W  [0603]  26.97,33.07 90 top
R1417  10k, 10%, 1/10W  [0603]  41.15,31.24 0 top
R1418  10k, 10%, 1/10W  [0603]  43.89,32 0 top
R1419  10k, 10%, 1/10W  [0603]  41.15,32.77 0 top
R1420  10k, 10%, 1/10W  [0603]  43.89,33.53 0 top
R1421  10k, 10%, 1/10W  [0603]  41.15,34.29 0 top
R1422  10k, 10%, 1/10W  [0603]  57.3,29.41 0 top
R1423  10k, 10%, 1/10W  [0603]  60.05,30.18 0 top
R1424  10k, 10%, 1/10W  [0603]  57.3,30.94 0 top
R1425  10k, 10%, 1/10W  [0603]  60.05,31.7 0 top
R1426  10k, 10%, 1/10W  [0603]  60.05,34.75 0 top
R1427  10k, 10%, 1/10W  [0603]  57.3,33.99 0 top
R1428  10k, 10%, 1/10W  [0603]  60.05,33.22 0 top
R1429  10k, 10%, 1/10W  [0603]  57.3,32.46 0 top
SJ1001  OPT  [SJ]  57.91,87.02 270 top
SJ1101  OPT  [SJ]  57.91,83.21 270 top
SJ1501  [SJ']  10.67,97.84 180 top
SJ1502  [SJ']  36.58,97.84 0 top
T401  PBHV8115Z  [D_SMD_SOT223_(SC-73)_R_NXP_REV01]  74.98,46.48 270 top
T501  PBHV8115Z  [D_SMD_SOT223_(SC-73)_R_NXP_REV01]  38.56,46.48 270 top
T1201  NX2301P  [D_SMD_SOT23_(TO-236AB)_R_NXP_REV01]  53.49,21.95 180 top
T1202  NX2301P  [D_SMD_SOT23_(TO-236AB)_R_NXP_REV01]  45.26,21.95 180 top
T1203  NX2301P  [D_SMD_SOT23_(TO-236AB)_R_NXP_REV01]  37.03,21.95 180 top
T1204  NX2301P  [D_SMD_SOT23_(TO-236AB)_R_NXP_REV01]  28.8,21.95 180 top
T1205  NX2301P  [D_SMD_SOT23_(TO-236AB)_R_NXP_REV01]  20.57,21.95 180 top
T1206  NX2301P  [D_SMD_SOT23_(TO-236AB)_R_NXP_REV01]  12.34,22.1 180 top
T1207  NX2301P  [D_SMD_SOT23_(TO-236AB)_R_NXP_REV01]  102.87,21.95 180 top
T1208  NX2301P  [D_SMD_SOT23_(TO-236AB)_R_NXP_REV01]  94.64,21.95 180 top
T1209  NX2301P  [D_SMD_SOT23_(TO-236AB)_R_NXP_REV01]  86.41,21.95 180 top
T1210  NX2301P  [D_SMD_SOT23_(TO-236AB)_R_NXP_REV01]  78.18,21.95 180 top
T1211  NX2301P  [D_SMD_SOT23_(TO-236AB)_R_NXP_REV01]  69.95,21.95 180 top
T1212  NX2301P  [D_SMD_SOT23_(TO-236AB)_R_NXP_REV01]  61.72,21.95 180 top
TR601  HX1188NL  [TR_SMD_SOIC-16_(12,70MMX9,53MMX5,97MM)_R_PULSE_REV01]  106.68,83.97 0 top
TR701  HX1188NL  [TR_SMD_SOIC-16_(12,70MMX9,53MMX5,97MM)_R_PULSE_REV01]  90.22,83.97 0 top
U$50  [FIDUCIAL_1MM]  3.17,21.27 0 top
U$52  [FIDUCIAL_1MM]  117.47,74.61 0 top
U$62  [FIDUCIAL_1MM]  81.28,107.31 0 top
X1601  43045-0406_MOLEX_4PIN  [X_SMD_MOLEX_43045-0408_R_REV01]  106.2,107.46 180 top
X1602  43045-0406_MOLEX_4PIN  [X_SMD_MOLEX_43045-0408_R_REV01]  90.22,107.46 180 top
X1603  43045-1606_MOLEX_16PIN  [X_SMD_MOLEX_43045-1608_R_REV01]  23.62,107.46 180 top
X1604  MA10-2  [MA10-2]  112.47,41.3 90 top
X1605  MA09-2  [MA09-2]  112.49,65.44 90 top
X1606  43045-2406_MOLEX_24PIN  [X_SMD_MOLEX_43045-2408_R_REV01]  58.22,107.46 180 top
X1607  MA10-2  [MA10-2]  103.63,41.3 90 top
X1608  MA10-2  [MA10-2]  94.64,41.3 90 top
Z401  60V,500mW  [D_SMD_SOD-123_R_ON_REV01]  78.03,59.13 90 top
Z501  60V,500mW  [D_SMD_SOD-123_R_ON_REV01]  41.61,59.13 90 top
Z801  6.8V, 500mW  [D_SMD_SOD-123_R_ON_REV01]  61.11,57.61 0 top
Z802  6.8V, 500mW  [D_SMD_SOD-123_R_ON_REV01]  58.83,55.63 0 top
Z803  6.8V, 500mW  [D_SMD_SOD-123_R_ON_REV01]  56.54,57.61 0 top
Z804  6.8V, 500mW  [D_SMD_SOD-123_R_ON_REV01]  54.25,55.63 0 top
Z805  6.8V, 500mW  [D_SMD_SOD-123_R_ON_REV01]  51.97,57.61 0 top
Z806  6.8V, 500mW  [D_SMD_SOD-123_R_ON_REV01]  49.68,55.63 0 top
Z807  6.8V, 500mW  [D_SMD_SOD-123_R_ON_REV01]  47.4,57.61 0 top
Z808  6.8V, 500mW  [D_SMD_SOD-123_R_ON_REV01]  74.83,57.61 0 top
Z809  6.8V, 500mW  [D_SMD_SOD-123_R_ON_REV01]  72.54,55.63 0 top
Z810  6.8V, 500mW  [D_SMD_SOD-123_R_ON_REV01]  70.26,57.61 0 top
Z811  6.8V, 500mW  [D_SMD_SOD-123_R_ON_REV01]  67.97,55.63 0 top
Z812  6.8V, 500mW  [D_SMD_SOD-123_R_ON_REV01]  65.68,57.61 0 top
Z813  6.8V, 500mW  [D_SMD_SOD-123_R_ON_REV01]  63.4,55.63 0 top
Z901  6.8V, 500mW  [D_SMD_SOD-123_R_ON_REV01]  24.69,57.61 0 top
Z902  6.8V, 500mW  [D_SMD_SOD-123_R_ON_REV01]  22.4,55.63 0 top
Z903  6.8V, 500mW  [D_SMD_SOD-123_R_ON_REV01]  20.12,57.61 0 top
Z904  6.8V, 500mW  [D_SMD_SOD-123_R_ON_REV01]  17.83,55.63 0 top
Z905  6.8V, 500mW  [D_SMD_SOD-123_R_ON_REV01]  15.54,57.61 0 top
Z906  6.8V, 500mW  [D_SMD_SOD-123_R_ON_REV01]  13.26,55.63 0 top
Z907  6.8V, 500mW  [D_SMD_SOD-123_R_ON_REV01]  10.97,57.61 0 top
Z908  6.8V, 500mW  [D_SMD_SOD-123_R_ON_REV01]  38.4,57.61 0 top
Z909  6.8V, 500mW  [D_SMD_SOD-123_R_ON_REV01]  36.12,55.63 0 top
Z910  6.8V, 500mW  [D_SMD_SOD-123_R_ON_REV01]  33.83,57.61 0 top
Z911  6.8V, 500mW  [D_SMD_SOD-123_R_ON_REV01]  31.55,55.63 0 top
Z912  6.8V, 500mW  [D_SMD_SOD-123_R_ON_REV01]  29.26,57.61 0 top
Z913  6.8V, 500mW  [D_SMD_SOD-123_R_ON_REV01]  26.97,55.63 0 top

## Tracks (layer width: path | path; a pad name or v marks a point on that pad's centre or on a via)
+3.0V_VREF2_0  (via drill 0.3)
  Top 0.152: v67.97,37.34 67.97,34.75 68.28,34.44 LSP403.P$1 | 61.27,92.96 62,92.96 R1008.2
  Top 0.254: R1003.2 68.86,90.04 69.52,90.7 R1001.2 v70.26,91.9 | R1005.2 62.05,95.38 v61.27,96.16 | R1011.2 70.28,95.99 v70.1,96.16 | R1013.2 73.03,95.89 v73.3,96.16 | R1009.2 67.54,95.83 v67.21,96.16 | R1007.2 64.8,95.53 v64.16,96.16 | R1006.2 61.27,92.96 | 62.79,92.99 R1008.2 R1004.2 59.74,92.99 | 62.79,92.99 R1012.2 64.31,92.99 | 64.31,92.99 R1016.2 | R1010.2 62.79,92.99 | R1014.2 64.31,92.99 | 70.71,34.14 LSP403.P$1 | C401.2 59.44,40.17 59.44,40.39 60.07,41.02 60.07,42.78 IC201.34 | C401.2 59.28,40.02 | C401.2 58.83,40.61 v58.83,41.15 | R1002.2 59.74,92.99 | R1015.2 75.77,95.43 v76.5,96.16 77.11,95.56 C1001.2 77.11,94.49 77.27,94.34 77.88,94.34 78.03,94.18 78.03,92.05 77.72,91.75 v77.11,91.75 | 59.74,92.99 59.28,92.99 v59.28,95.25
  Signals1 0.254: v70.26,91.9 70.26,96.01 v70.1,96.16 | v84.73,79.7 79.1,79.7 77.42,81.38 77.42,91.44 v77.11,91.75 | v70.1,96.16 v67.21,96.16 v64.16,96.16 v61.27,96.16 59.59,96.16 59.28,95.86 v59.28,95.25 | v70.1,96.16 v73.3,96.16 v76.5,96.16 | v87.78,37.34 v67.97,37.34 66.6,38.71 59.59,38.71 58.83,39.47 v58.83,41.15
  Signals2 0.152: v107.75,50.24 111.2,50.24 X1604.18
  Bottom 0.152: 88.24,39.01 97.08,39.01 97.38,39.32 97.38,41.15 97.69,41.45 106.53,41.45 106.83,41.76 106.83,49.99 107.09,50.24 v107.75,50.24
  Bottom 0.254: v84.73,79.7 86.41,79.7 87.02,79.1 87.02,49.38 88.24,48.16 88.24,39.01 88.24,37.8 v87.78,37.34
+3.0V_VREF2_1  (via drill 0.3)
  Top 0.152: LSP503.P$1 18.44,34.44 18.75,34.75 v18.75,39.17
  Top 0.254: 43.13,92.99 R1104.2 41.58,92.99 | 43.13,92.99 R1108.2 44.65,92.99 | 44.65,92.99 R1112.2 46.18,92.99 | R1116.2 46.18,92.99 | 41.6,90.53 R1102.2 41.6,92.96 41.58,92.99 | R1106.2 43.13,92.99 | R1110.2 44.65,92.99 | R1114.2 46.18,92.99 | R1115.2 57.63,95.58 v58.22,96.16 | R1107.2 46.66,95.68 v46.18,96.16 | R1111.2 52.15,96.04 v52.27,96.16 | R1109.2 49.4,95.99 v49.23,96.16 | R1113.2 54.89,95.89 v55.17,96.16 | R1103.2 50.57,90.04 51.23,90.7 R1101.2 v51.97,91.9 | R1105.2 43.92,95.38 v43.13,96.16 | v18.75,39.17 19.05,39.47 22.71,39.47 22.86,39.62 C501.2 23.57,40.97 23.57,42.78 IC301.34 | 41.58,92.99 40.84,92.99 | 40.84,92.99 v39.9,92.99 | v41,95.4 41.3,95.4 41.6,95.1 41.6,93.88 41.45,93.73 41,93.73 40.84,93.57 C1101.2 40.84,92.99
  Signals1 0.152: v58.22,96.16 58.98,96.93 76.81,96.93 77.88,95.86 77.88,81.53 79.1,80.31 85.19,80.31 85.65,79.86 96.16,79.86 97.84,78.18 v97.84,78.03 | v97.84,57.45 98.3,57 108.66,57 109.12,56.54 109.12,51.82 109.42,51.51 113.54,51.51 113.74,51.31 X1604.17
  Signals1 0.254: v17.37,43.74 8.08,43.74 7.32,44.5 7.32,92.51 7.8,92.99 v39.9,92.99 | v58.22,96.16 v55.17,96.16 v52.27,96.16 | v52.27,96.16 v49.23,96.16 v46.18,96.16 v43.13,96.16 41.3,96.16 41,95.86 v41,95.4 | v51.97,91.9 51.97,95.86 v52.27,96.16
  Bottom 0.152: v97.84,78.03 v97.84,57.45
  Bottom 0.254: v18.75,39.17 18.29,39.17 17.83,39.62 17.83,43.28 v17.37,43.74
+5.0V_VREG_0  (via drill 0.3)
  Top 0.152: LSP401.P$1 70.41,38.1 v71.93,38.1 | v89.81,67.37 89.61,67.33 C1701.2 | 88.8,67.29 C1701.2 | M1001.16 74.24,80.71 C1002.2 74.83,79.1 v75.29,79.55 | M1002.16 64.55,81.9 v64.47,81.99 | IC1701.4 88.8,67.39 C1701.2
  Top 0.254: R601.2 R608.2 v62.03,37.34 | v64.47,81.99 64.64,81.99 C1004.2 | 65.78,80.75 C1004.2 | C1004.2 65.84,82.05 O1001.6 | 92.57,58.28 C1301.2 | C1301.2 92.51,57.76 92.81,57.45 v95.4,57.45 | R606.2 57.91,37.64 58.22,37.34 v59.44,37.34 | R1018.2 81.99,47.7 82.14,47.85 85.95,47.85 86.11,47.7 R1017.2 87.15,47.07 v87.17,47.09 | C405.2 68.05,44.65 62.33,44.65 61.57,43.89 61.57,42.81 IC201.37 | 71.55,44.04 71.64,44.04 T401.3 | M1002.16 64.55,79.16 C1003.2 | M1002.13 62.65,81.85 v62.79,81.99 | M1301.16 94.12,58.34 C1301.2 | v95.4,66.9 95.39,66.92 M1302.12 M1302.13
  Top 0.305: M1301.12 95.11,60.82 v95.4,61.11 | 92.57,64.38 92.57,63.79 92.66,63.7 95.25,63.7 v95.4,63.86 | M1302.16 92.57,64.38 | 92.57,64.38 C1302.2
  Top 0.406: C405.2 71.55,44.04
  Top 0.711: C405.2 68.73,43.97 v68.73,43.13
  pour V_REG (isolate 0.305, no thermals): 58.52,110.03 58.52,76.81 51.97,76.81 51.97,0 119.94,0 119.94,110.03
+5.0V_VREG_1  (via drill 0.3)
  Top 0.152: v48.01,40.08 48.01,39.14 C1402.2 48.07,38.95 M1402.16 | v14.33,37.95 LSP501.P$1 | 39.86,37.56 39.62,37.95 37.82,37.95 C1801.2 38.08,37.95 v37.03,37.95 | M1101.16 56.02,79.16 | 31.76,38.95 M1401.16
  Top 0.254: C1103.2 46.27,79.16 M1102.16 46.29,80.8 C1104.2 | 56.02,79.16 C1102.2 56.84,79.1 57.15,79.4 v57.15,80.16 | C1104.2 46.33,82.02 v46.33,82.14 | C1104.2 47.7,80.95 | 48.07,39.01 C1402.2 | R706.2 v20.12,37.64 | R708.2 v25.6,37.64 | R701.2 v26.98,37.64 | v30.94,39.01 C1401.2 31.76,38.95 | R1407.1 10.03,20.09 10.06,20.12 v10.06,19.05 | T501.3 32.17,44.18 C505.2 31.8,44.53 25.32,44.53 25.07,44.28 25.07,42.81 IC301.37 | R1118.2 45.72,47.7 45.87,47.85 49.68,47.85 49.84,47.7 R1117.2 v49.84,46.02 | O1101.6 47.61,80.86 C1104.2 | M1102.13 v44.36,82.13 v44.35,82.14 | M1402.16 48.07,36.51 48.16,36.42 49.99,36.42 49.99,37.33 M1402.13 M1402.12 | IC1801.4 39.76,37.46 39.86,37.56
  Top 0.305: M1401.16 31.76,36.5 32.07,36.2 33.97,36.2 34.29,36.51 34.29,37.33 M1401.12
  Top 0.406: C505.2 32.16,43.43 v32.31,43.28
  Signals1 0.152: v67.97,38.71 68.12,38.86 108.81,38.86 109.12,39.17 109.12,48.62 109.42,48.92 113.54,48.92 113.74,48.72 X1604.15
  Signals2 0.152: v67.97,38.71 48.44,38.71 C1402.2 48.13,39.95 v48.01,40.08
  pour V_REG (isolate 0.305, no thermals): 0,110.03 58.06,110.03 58.06,77.27 51.51,77.27 51.51,0 0,0
CELL0_FEEDBACK  (via drill 0.3)
  Top 0.152: R1414.1 30.48,32.28 | 30.48,32.28 31.76,32.28 | v30.79,33.68 30.79,32.59 30.48,32.28
  Top 0.254: v17.58,26.72 IC1406.3 | 31.76,32.28 M1401.1
  Signals1 0.152: v17.58,26.72 17.58,33.27 v17.98,33.68
  Bottom 0.152: v17.98,33.68 18.59,34.29 30.33,34.29 30.79,33.83 v30.79,33.68
CELL0_FEEDBACK+  (via drill 0.3)
  Top 0.152: 12.32,13.2 arc45 12.33,13.19 R1206.2
  Top 0.254: T1206.3 arc90 12.32,21.07 R1406.2 12.32,13.2
  other vias: 11.43,16.46 12.95,16.46 14.48,16.46 16,16.46 17.53,16.46 12.19,15.54 13.72,15.54 15.24,15.54 16.76,15.54 11.43,14.63 12.95,14.63 14.48,14.63 16,14.63 17.53,14.63
  pour Top (no thermals): 10.82,10.97 10.82,18.41 arc-90 10.85,18.44 18.44,18.44 18.41,10.97
  pour Bottom (no thermals): 10.82,11.13 10.82,18.41 arc-90 10.85,18.44 18.44,18.44 18.41,11.13
CELL1_FEEDBACK  (via drill 0.3)
  Top 0.152: v25.3,33.68 25.91,33.07 27.74,33.07 28.35,32.46 R1415.1 28.35,31.55 28.8,31.09 32.16,31.09 32.4,31.33 M1401.2
  Top 0.254: v25.81,26.67 IC1405.3
  Signals1 0.152: v25.81,26.67 25.15,27.33 25.15,33.53 v25.3,33.68
CELL1_FEEDBACK+  (via drill 0.3)
  Top 0.152: 20.55,13.2 arc45 20.56,13.19 R1205.2
  Top 0.254: 20.57,19.7 arc-45 20.57,19.68 R1405.2 | R1405.2 20.55,13.2 | T1205.3 20.57,19.68 R1405.2
  other vias: 19.81,16.46 21.34,16.46 22.86,16.46 24.38,16.46 25.91,16.46 20.57,15.54 22.1,15.54 23.62,15.54 25.15,15.54 19.81,14.63 21.34,14.63 22.86,14.63 24.38,14.63 25.91,14.63
  pour Top (no thermals): 19.05,10.97 19.05,18.41 arc-90 19.08,18.44 26.67,18.44 26.64,10.97
  pour Bottom (no thermals): 19.2,11.13 19.2,18.41 arc-90 19.23,18.44 26.67,18.44 26.64,11.13
CELL2_FEEDBACK
  Top 0.152: 33.07,31.09 33.07,32.08 | 33.07,31.09 32.31,30.33 27.74,30.33 26.98,31.09 R1416.1 | 33.07,31.09 34.04,30.12 IC1404.3
  Top 0.254: M1401.3 33.07,32.12 33.07,32.08
CELL2_FEEDBACK+  (via drill 0.3)
  Top 0.152: 28.78,13.2 arc45 28.79,13.19 R1204.2
  Top 0.254: T1204.3 28.79,20.93 arc45 28.78,20.91 R1404.2 28.78,13.2
  other vias: 28.04,16.46 29.57,16.46 31.09,16.46 32.61,16.46 34.14,16.46 28.8,15.54 30.33,15.54 31.85,15.54 33.38,15.54 28.04,14.63 29.57,14.63 31.09,14.63 32.61,14.63 34.14,14.63
  pour Top (no thermals): 27.28,10.97 27.28,18.41 arc-90 27.3,18.44 34.9,18.44 34.87,10.97
  pour Bottom (no thermals): 27.43,11.13 27.43,18.41 arc-90 27.46,18.44 34.9,18.44 34.87,11.13
CELL3_FEEDBACK
  Top 0.152: M1401.4 33.67,31.08 34.27,30.48 37.34,30.48 38.1,31.24 R1417.1 40.36,28.83 42.27,26.92 IC1403.3
CELL3_FEEDBACK+  (via drill 0.3)
  Top 0.152: 37.01,13.2 arc45 37.02,13.19 R1203.2
  Top 0.254: T1203.3 37.02,20.93 arc45 37.01,20.91 R1403.2 37.01,13.2
  other vias: 36.27,16.46 37.8,16.46 39.32,16.46 40.84,16.46 42.37,16.46 37.03,15.54 38.56,15.54 40.08,15.54 41.61,15.54 36.27,14.63 37.8,14.63 39.32,14.63 40.84,14.63 42.37,14.63
  pour Top (no thermals): 35.51,10.97 35.51,18.41 arc-90 35.53,18.44 43.13,18.44 43.1,10.97
  pour Bottom (no thermals): 35.66,11.13 35.66,18.41 arc-90 35.69,18.44 43.13,18.44 43.1,11.13
CELL4_FEEDBACK
  Top 0.152: M1401.5 34.3,31.08 34.59,30.79 37.19,30.79 37.64,31.24 37.64,31.85 37.8,32 R1418.1 43.1,28.83 43.59,28.35 45.87,28.35 46.18,28.04 48.46,28.04 48.77,27.74 49.68,27.74 50.49,26.92 IC1402.3
CELL4_FEEDBACK+  (via drill 0.3)
  Top 0.152: 45.24,13.2 arc45 45.24,13.19 R1202.2
  Top 0.254: T1202.3 45.24,20.93 arc45 45.24,20.91 R1402.2 45.24,13.2
  other vias: 44.5,16.46 46.02,16.46 47.55,16.46 49.07,16.46 50.6,16.46 45.26,15.54 46.79,15.54 48.31,15.54 49.83,15.54 44.5,14.63 46.02,14.63 47.55,14.63 49.07,14.63 50.6,14.63
  pour Top (no thermals): 43.74,10.97 43.74,18.41 arc-90 43.76,18.44 51.36,18.44 51.33,10.97
  pour Bottom (no thermals): 43.89,11.13 43.89,18.41 arc-90 44.07,18.44 51.36,18.44 51.33,11.13
CELL5_FEEDBACK  (via drill 0.3)
  Top 0.152: R1419.1 39.62,32.77 | 39.62,32.77 37.64,32.77 37.34,32.46 37.34,31.39 37.03,31.09 35.2,31.09 34.94,31.36 M1401.6 | v44.96,30.18 44.96,29.72 46.33,28.35 48.62,28.35 48.92,28.04 51.21,28.04 51.51,27.74 54.25,27.74 54.56,27.43 58.22,27.43 58.73,26.92 IC1401.3 | v39.32,33.38 39.32,33.07 39.62,32.77
  Signals1 0.152: v44.96,30.18 44.96,32.77 44.35,33.38 v39.32,33.38
CELL5_FEEDBACK+  (via drill 0.3)
  Top 0.152: 53.47,13.2 arc45 53.47,13.19 R1201.2
  Top 0.254: T1201.3 53.47,20.93 arc45 53.47,20.91 R1401.2 53.47,13.2
  other vias: 52.73,16.46 54.25,16.46 55.78,16.46 57.3,16.46 58.83,16.46 53.49,15.54 55.02,15.54 56.54,15.54 58.06,15.54 52.73,14.63 54.25,14.63 55.78,14.63 57.3,14.63 58.83,14.63
  pour Top (no thermals): 51.97,10.97 51.97,18.41 arc-90 51.99,18.44 59.59,18.44 59.56,10.97
  pour Bottom (no thermals): 52.12,11.13 52.12,18.41 arc-90 52.15,18.44 59.59,18.44 59.56,11.13
CELL6_FEEDBACK
  Top 0.152: R1420.1 43.1,34.59 | 43.1,34.59 43.1,34.92 42.82,35.2 35.97,35.2 35.57,34.81 M1401.7 | 43.1,34.59 45.26,34.59 45.57,34.29 45.57,29.57 46.48,28.65 48.77,28.65 49.07,28.35 51.36,28.35 51.66,28.04 54.41,28.04 54.71,27.74 65.68,27.74 66.95,26.47 IC1412.3
CELL6_FEEDBACK+  (via drill 0.3)
  Top 0.152: 61.7,13.2 arc45 61.7,13.19 R1224.2
  Top 0.254: T1212.3 61.7,20.93 arc45 61.7,20.91 R1413.2 61.7,13.2
  other vias: 60.96,16.46 62.48,16.46 64.01,16.46 65.53,16.46 67.06,16.46 61.72,15.54 63.25,15.54 64.77,15.54 66.29,15.54 60.96,14.63 62.48,14.63 64.01,14.63 65.53,14.63 67.06,14.63
  pour Top (no thermals): 60.2,10.97 60.2,18.41 arc-90 60.22,18.44 67.82,18.44 67.79,10.97
  pour Bottom (no thermals): 60.35,11.13 60.35,18.41 arc-90 60.38,18.44 67.82,18.44 67.79,11.13
CELL7_FEEDBACK  (via drill 0.3)
  Top 0.152: R1421.1 v39.32,34.29 36.58,34.29 36.21,33.92 M1401.8 | v47.09,33.83 47.09,29.26 47.4,28.96 48.92,28.96 49.23,28.65 51.51,28.65 51.82,28.35 54.56,28.35 54.86,28.04 65.84,28.04 66.14,27.74 74.37,27.74 75.18,26.92 IC1411.3
  Bottom 0.152: v47.09,33.83 46.63,34.29 v39.32,34.29
CELL7_FEEDBACK+  (via drill 0.3)
  Top 0.152: 69.93,13.2 arc45 69.93,13.19 R1223.2
  Top 0.254: T1211.3 69.93,20.93 arc45 69.93,20.91 R1412.2 69.93,13.2
  other vias: 69.19,16.46 70.71,16.46 72.24,16.46 73.76,16.46 75.29,16.46 69.95,15.54 71.48,15.54 73,15.54 74.52,15.54 69.19,14.63 70.71,14.63 72.24,14.63 73.76,14.63 75.29,14.63
  pour Top (no thermals): 68.43,10.97 68.43,18.41 arc-90 68.45,18.44 76.05,18.44 76.02,10.97
  pour Bottom (no thermals): 68.58,11.13 68.58,18.41 arc-90 68.61,18.44 76.05,18.44 76.02,11.13
CELL8_FEEDBACK
  Top 0.152: M1402.1 48.07,31 49.66,29.41 R1422.1 56.54,29.39 56.54,28.65 56.84,28.35 65.99,28.35 66.29,28.04 74.52,28.04 74.83,27.74 82.6,27.74 83.41,26.92 IC1410.3
CELL8_FEEDBACK+  (via drill 0.3)
  Top 0.152: 78.16,13.2 arc45 78.16,13.19 R1222.2
  Top 0.254: T1210.3 78.16,20.93 arc45 78.16,20.91 R1411.2 78.16,13.2
  other vias: 77.42,16.46 78.94,16.46 80.47,16.46 81.99,16.46 83.52,16.46 78.18,15.54 79.71,15.54 81.23,15.54 82.75,15.54 77.42,14.63 78.94,14.63 80.47,14.63 81.99,14.63 83.52,14.63
  pour Top (no thermals): 76.66,10.97 76.66,18.41 arc-90 76.68,18.44 84.28,18.44 84.25,10.97
  pour Bottom (no thermals): 76.81,11.13 76.81,18.41 arc-90 76.83,18.44 84.28,18.44 84.25,11.13
CELL9_FEEDBACK  (via drill 0.3)
  Top 0.152: R1423.1 v55.47,30.18 49.53,30.18 48.7,31 M1402.2 | v63.09,30.18 63.25,30.02 63.25,28.8 63.4,28.65 66.14,28.65 66.45,28.35 74.68,28.35 74.98,28.04 82.75,28.04 83.06,27.74 90.83,27.74 91.64,26.92 IC1409.3
  Bottom 0.152: v63.09,30.18 v55.47,30.18
CELL9_FEEDBACK+  (via drill 0.3)
  Top 0.152: 86.39,13.2 arc45 86.39,13.19 R1221.2
  Top 0.254: T1209.3 86.39,20.93 arc45 86.39,20.91 R1410.2 86.39,13.2
  other vias: 85.65,16.46 87.17,16.46 88.7,16.46 90.22,16.46 91.74,16.46 86.41,15.54 87.93,15.54 89.46,15.54 90.98,15.54 85.65,14.63 87.17,14.63 88.7,14.63 90.22,14.63 91.74,14.63
  pour Top (no thermals): 84.89,10.97 84.89,18.41 arc-90 84.91,18.44 92.51,18.44 92.48,10.97
  pour Bottom (no thermals): 85.04,11.13 85.04,18.41 arc-90 85.06,18.44 92.51,18.44 92.48,11.13
CELL10_FEEDBACK  (via drill 0.3)
  Top 0.152: R1424.1 v54.86,30.94 54.71,30.94 54.56,30.79 49.53,30.79 49.34,30.98 M1402.3 | v62.48,30.94 63.55,30.94 63.7,30.79 63.7,29.11 63.86,28.96 66.29,28.96 66.6,28.65 74.83,28.65 75.13,28.35 82.91,28.35 83.21,28.04 90.98,28.04 91.29,27.74 99.06,27.74 99.87,26.92 IC1408.3
  Bottom 0.152: v62.48,30.94 v54.86,30.94
CELL10_FEEDBACK+  (via drill 0.3)
  Top 0.152: 94.61,13.2 arc45 94.62,13.19 R1220.2
  Top 0.254: T1208.3 94.62,20.93 arc45 94.61,20.91 R1409.2 94.61,13.2
  other vias: 93.88,16.46 95.4,16.46 96.93,16.46 98.45,16.46 99.97,16.46 94.64,15.54 96.16,15.54 97.69,15.54 99.21,15.54 93.88,14.63 95.4,14.63 96.93,14.63 98.45,14.63 99.97,14.63
  pour Top (no thermals): 93.12,10.97 93.12,18.41 arc-90 93.14,18.44 100.74,18.44 100.71,10.97
  pour Bottom (no thermals): 93.27,11.13 93.27,18.41 arc-90 93.29,18.44 100.74,18.44 100.71,11.13
CELL11_FEEDBACK  (via drill 0.3)
  Top 0.152: R1425.1 v55.47,31.7 54.41,31.7 53.8,31.09 50.14,31.09 49.97,31.25 M1402.4 | v63.09,31.7 63.86,31.7 64.01,31.55 64.01,29.41 64.16,29.26 66.45,29.26 66.75,28.96 74.98,28.96 75.29,28.65 83.06,28.65 83.36,28.35 91.14,28.35 91.44,28.04 99.21,28.04 99.52,27.74 107.29,27.74 108.1,26.92 IC1407.3
  Bottom 0.152: v63.09,31.7 v55.47,31.7
CELL11_FEEDBACK+  (via drill 0.3)
  Top 0.152: 102.84,13.2 arc45 102.85,13.19 R1225.2
  Top 0.254: T1207.3 102.85,20.93 arc45 102.84,20.91 R1408.2 102.84,13.2
  other vias: 102.11,16.46 103.63,16.46 105.16,16.46 106.68,16.46 108.2,16.46 102.87,15.54 104.39,15.54 105.92,15.54 107.44,15.54 102.11,14.63 103.63,14.63 105.16,14.63 106.68,14.63 108.2,14.63
  pour Top (no thermals): 101.35,10.97 101.35,18.41 arc-90 101.37,18.44 108.97,18.44 108.94,10.97
  pour Bottom (no thermals): 101.5,11.13 101.5,18.41 arc-90 101.52,18.44 109.12,18.44 109.09,11.13
CELL_0+
  Top 0.406: X1603.2 16.12,101.01 14.63,99.52 14.63,93.75 F1503.1
CELL_0-
  Top 0.406: SJ1501.1 12.64,97.84 X1603.9 13.12,94.53 F1502.1
CELL_1+
  Top 0.406: X1603.10 16.12,92.96 F1504.1
CELL_2+
  Top 0.406: X1603.3 19.12,100.96 17.68,99.52 17.68,92.23 F1505.1
CELL_3+
  Top 0.406: X1603.11 19.12,91.39 F1506.1
CELL_4+
  Top 0.406: X1603.4 22.12,100.91 20.57,99.36 20.57,90.55 F1507.1
CELL_5+
  Top 0.406: F1508.1 22.12,90.68 X1603.12
CELL_6+
  Top 0.406: X1603.5 25.12,100.86 23.62,99.36 23.62,91.47 F1509.1
CELL_7+
  Top 0.406: F1510.1 25.12,92.25 X1603.13
CELL_8+
  Top 0.406: X1603.6 28.12,100.82 26.67,99.36 26.67,92.99 F1511.1
CELL_9+
  Top 0.406: F1512.1 28.12,93.82 X1603.14
CELL_10+
  Top 0.406: X1603.7 31.12,100.77 29.72,99.36 29.72,94.51 F1513.1
CELL_11+
  Top 0.406: SJ1502.2 37.34,99.06 36.73,99.67 32.46,99.67 31.12,98.33 X1603.15 31.12,96.32 31.12,95.98 31.12,95.39 F1514.1
FUSED_CELL_0+  (via drill 0.3)
  Top 0.152: 26.06,6.25 25.91,6.1
  Top 0.254: 26.56,19.75 arc-45 26.58,19.75 v26.67,19.66 26.57,19.75 IC1405.2 | R906.1 14.63,70.56 11.12,74.07 v11.12,78.49 | v50.75,69.04 R806.1 | 11.4,26.7 v11.28,26.82 11.39,26.71 T1206.2
  Top 0.406: F1503.2 LSP1503.P$1 v11.12,78.49
  Signals1 0.254: v26.67,19.66 26.67,7.62 v25.91,6.86 | v9.14,77.27 10.52,77.27 11.12,77.88 v11.12,78.49
  Bottom 0.254: v50.75,69.04 50.75,69.49 50.44,69.8 11.89,69.8 11.12,70.56 v11.12,78.49 | v9.14,77.27 5.49,77.27 5.03,76.81 5.03,29.41 5.94,28.5 9.6,28.5 v11.28,26.82 13.56,24.54 18.44,24.54 20.88,22.1 20.88,21.95 24.69,21.95 26.67,19.96 v26.67,19.66
  other vias: 19.81,6.86 21.34,6.86 22.86,6.86 24.38,6.86 20.57,5.94 22.1,5.94 23.62,5.94 25.15,5.94 19.81,5.03 21.34,5.03 22.86,5.03 24.38,5.03 25.91,5.03
  pour Top (no thermals): 19.05,10.36 26.67,10.36 26.64,1.22 19.05,1.22
  pour Bottom (no thermals): 19.2,10.21 26.67,10.21 26.64,1.22 19.2,1.22
FUSED_CELL_0+2
  Signals1 0.254: 76.05,6.87 arc-45 76.04,6.85
FUSED_CELL_0-  (via drill 0.3)
  Top 0.254: R807.1 48.46,68.43 48.16,68.73 v47.4,68.73 | R907.1 12.34,70.56 10.21,72.69 10.21,77.72 9.45,78.49 v9.14,78.49
  Top 0.406: F1502.2 LSP1502.P$1 8.84,78.79 v9.14,78.49
  Bottom 0.254: v47.4,68.73 47.09,69.04 11.12,69.04 10.21,69.95 10.21,77.72 9.45,78.49 v9.14,78.49
FUSED_CELL_1+  (via drill 0.3)
  Top 0.254: T1205.2 19.66,22.96 v19.66,26.52 | R905.1 16.92,70.87 13.41,74.37 v13.41,78.49 | v53.03,69.04 R805.1 | IC1404.2 34.8,19.75 v34.9,19.66
  Top 0.406: F1504.2 LSP1504.P$1 v13.41,78.49
  Signals1 0.254: v9.14,76.05 12.65,76.05 13.41,76.81 v13.41,78.49 | v34.9,19.66 34.9,7.62 v34.14,6.86
  Bottom 0.254: v53.03,69.04 53.03,70.1 52.58,70.56 14.17,70.56 13.41,71.32 v13.41,78.49 | v9.14,76.05 6.25,76.05 5.79,75.59 5.79,30.18 6.71,29.26 16.92,29.26 v19.66,26.52 21.79,24.38 26.52,24.38 28.96,21.95 33.07,21.95 34.9,20.12 v34.9,19.66
  other vias: 28.04,6.86 29.57,6.86 31.09,6.86 32.61,6.86 28.8,5.94 30.33,5.94 31.85,5.94 33.38,5.94 28.04,5.03 29.57,5.03 31.09,5.03 32.61,5.03 34.14,5.03
  pour Top (no thermals): 27.28,10.36 34.9,10.36 34.87,1.22 27.28,1.22
  pour Bottom (no thermals): 27.43,10.21 34.9,10.21 34.87,1.22 27.43,1.22
FUSED_CELL_2+  (via drill 0.3)
  Top 0.254: R904.1 19.2,70.56 15.7,74.07 v15.7,78.49 | v55.32,69.04 R804.1 | T1204.2 v27.85,26.66 v27.86,26.67 | IC1403.2 42.88,19.75 v43.13,19.51
  Top 0.406: F1505.2 LSP1505.P$1 v15.7,78.49
  Signals1 0.254: v9.14,74.83 14.94,74.83 15.7,75.59 v15.7,78.49 | v43.13,19.51 43.13,7.62 v42.37,6.86
  Bottom 0.254: v55.32,69.04 55.32,70.56 54.56,71.32 16.46,71.32 15.7,72.08 v15.7,78.49 | v9.14,74.83 7.01,74.83 6.55,74.37 6.55,30.94 7.47,30.02 24.51,30.02 v27.86,26.67 30.15,24.38 34.9,24.38 37.34,21.95 41.15,21.95 43.13,19.96 v43.13,19.51
  other vias: 36.27,6.86 37.8,6.86 39.32,6.86 40.84,6.86 37.03,5.94 38.56,5.94 40.08,5.94 41.61,5.94 36.27,5.03 37.8,5.03 39.32,5.03 40.84,5.03 42.37,5.03
  pour Top (no thermals): 35.51,10.36 43.13,10.36 43.1,1.22 35.51,1.22
  pour Bottom (no thermals): 35.66,10.21 43.13,10.21 43.1,1.22 35.66,1.22
FUSED_CELL_3+  (via drill 0.3)
  Top 0.254: R903.1 21.49,70.56 17.98,74.07 v17.98,78.49 | v57.61,69.04 R803.1 | T1203.2 v36.08,26.66 v36.09,26.67 | IC1402.2 51.11,19.75 v51.36,19.51
  Top 0.406: F1506.2 LSP1506.P$1 v17.98,78.49
  Signals1 0.254: v9.14,73.61 17.22,73.61 17.98,74.37 v17.98,78.49 | v51.36,19.51 51.36,7.62 v50.6,6.86
  Bottom 0.254: v57.61,69.04 57.61,71.32 56.84,72.08 18.75,72.08 17.98,72.85 v17.98,78.49 | v9.14,73.61 7.77,73.61 7.32,73.15 7.32,31.7 8.23,30.79 31.98,30.79 v36.09,26.67 38.38,24.38 43.13,24.38 45.57,21.95 49.38,21.95 51.36,19.96 v51.36,19.51
  other vias: 44.5,6.86 46.02,6.86 47.55,6.86 49.07,6.86 45.26,5.94 46.79,5.94 48.31,5.94 49.83,5.94 44.5,5.03 46.02,5.03 47.55,5.03 49.07,5.03 50.6,5.03
  pour Top (no thermals): 43.74,10.36 51.36,10.36 51.33,1.22 43.74,1.22
  pour Bottom (no thermals): 43.89,10.21 51.36,10.21 51.33,1.22 43.89,1.22
FUSED_CELL_4+  (via drill 0.3)
  Top 0.254: R902.1 23.77,70.56 20.27,74.07 v20.27,78.49 | v59.89,69.04 R802.1 | T1202.2 v44.31,26.66 v44.32,26.67 | IC1401.2 59.34,19.75 v59.59,19.51
  Top 0.406: F1507.2 LSP1507.P$1 v20.27,78.49
  Signals1 0.254: v9.14,72.39 19.36,72.39 20.27,73.3 v20.27,78.49 | v59.59,19.51 59.59,7.62 v58.83,6.86
  Bottom 0.254: v59.89,69.04 59.89,72.08 59.13,72.85 21.03,72.85 20.27,73.61 v20.27,78.49 | v9.14,72.39 8.53,72.39 8.08,71.93 8.08,32.46 8.99,31.55 36.7,31.55 39.9,28.35 42.65,28.35 v44.32,26.67 46.61,24.38 51.36,24.38 53.8,21.95 58.06,21.95 59.59,20.42 v59.59,19.51
  other vias: 52.73,6.86 54.25,6.86 55.78,6.86 57.3,6.86 53.49,5.94 55.02,5.94 56.54,5.94 58.06,5.94 52.73,5.03 54.25,5.03 55.78,5.03 57.3,5.03 58.83,5.03
  pour Top (no thermals): 51.97,10.36 59.59,10.36 59.56,1.22 51.97,1.22
  pour Bottom (no thermals): 52.12,10.21 59.59,10.21 59.56,1.22 52.12,1.22
FUSED_CELL_5+  (via drill 0.3)
  Top 0.254: R901.1 26.06,70.56 22.55,74.07 v22.55,78.49 | v62.18,69.04 R801.1 | T1201.2 v52.54,26.66 v52.55,26.67 | IC1412.2 67.57,19.75 v67.82,19.51
  Top 0.406: F1508.2 LSP1508.P$1 v22.55,78.49
  Signals1 0.254: v9.14,71.17 21.64,71.17 22.55,72.08 v22.55,78.49 | v67.82,19.51 67.82,7.47 v67.21,6.86
  Bottom 0.254: v62.18,69.04 62.18,72.69 61.27,73.61 23.32,73.61 22.55,74.37 v22.55,78.49 | v9.14,71.17 9.3,71.17 8.84,70.71 8.84,33.07 9.6,32.31 46.91,32.31 v52.55,26.67 54.84,24.38 59.59,24.38 62.03,21.95 66.29,21.95 67.82,20.42 v67.82,19.51
  other vias: 61.11,6.86 62.64,6.86 64.16,6.86 65.68,6.86 61.87,5.94 63.4,5.94 64.92,5.94 66.45,5.94 61.11,5.03 62.64,5.03 64.16,5.03 65.68,5.03 67.21,5.03
  pour Top (no thermals): 60.2,10.36 67.82,10.36 67.79,1.22 60.2,1.22
  pour Bottom (no thermals): 60.35,10.21 67.82,10.21 67.79,1.22 60.35,1.22
FUSED_CELL_6+  (via drill 0.3)
  Top 0.254: T1212.2 60.81,22.96 v60.81,26.67 | v84.73,77.27 65.68,77.27 64.47,76.05 v64.47,69.04 R813.1 | R913.1 28.35,70.56 24.84,74.07 v24.84,78.49 | IC1411.2 75.8,19.75 v76.05,19.51
  Top 0.406: F1509.2 LSP1509.P$1 v24.84,78.49
  Signals1 0.254: v76.05,19.51 76.05,7.62 v75.29,6.86
  Bottom 0.254: v64.47,69.04 64.47,73.46 63.55,74.37 25.6,74.37 24.84,75.13 v24.84,78.49 | v76.05,19.51 76.05,20.27 74.37,21.95 70.26,21.95 67.82,24.38 63.09,24.38 v60.81,26.67 63.25,29.11 79.25,29.11 80.62,30.48 80.62,76.35 81.53,77.27 v84.73,77.27
  other vias: 69.19,6.86 70.71,6.86 72.24,6.86 73.76,6.86 69.95,5.94 71.48,5.94 73,5.94 74.52,5.94 69.19,5.03 70.71,5.03 72.24,5.03 73.76,5.03 75.29,5.03
  pour Top (no thermals): 68.43,10.36 76.05,10.36 76.02,1.22 68.43,1.22
  pour Bottom (no thermals): 68.58,10.21 76.05,10.21 76.02,1.22 68.58,1.22
FUSED_CELL_7+  (via drill 0.3)
  Top 0.254: T1211.2 69.04,22.96 v69.04,26.67 | v84.73,76.05 67.97,76.05 66.75,74.83 v66.75,69.04 R812.1 | R912.1 30.63,70.56 27.13,74.07 v27.13,78.49 | IC1410.2 84.03,19.75 v84.28,19.51
  Top 0.406: F1510.2 LSP1510.P$1 v27.13,78.49
  Signals1 0.254: v84.28,19.51 84.28,7.62 v83.52,6.86
  Bottom 0.254: v66.75,69.04 66.75,73.91 65.53,75.13 27.89,75.13 27.13,75.89 v27.13,78.49 | v84.28,19.51 84.28,20.12 82.45,21.95 78.33,21.95 75.89,24.38 71.32,24.38 v69.04,26.67 70.71,28.35 79.7,28.35 81.38,30.02 81.38,75.29 82.14,76.05 v84.73,76.05